# EAGLE schematic ALU (EAGLE 9.6.2)

## Sheet 1 of 8: Bus and A-bus end.
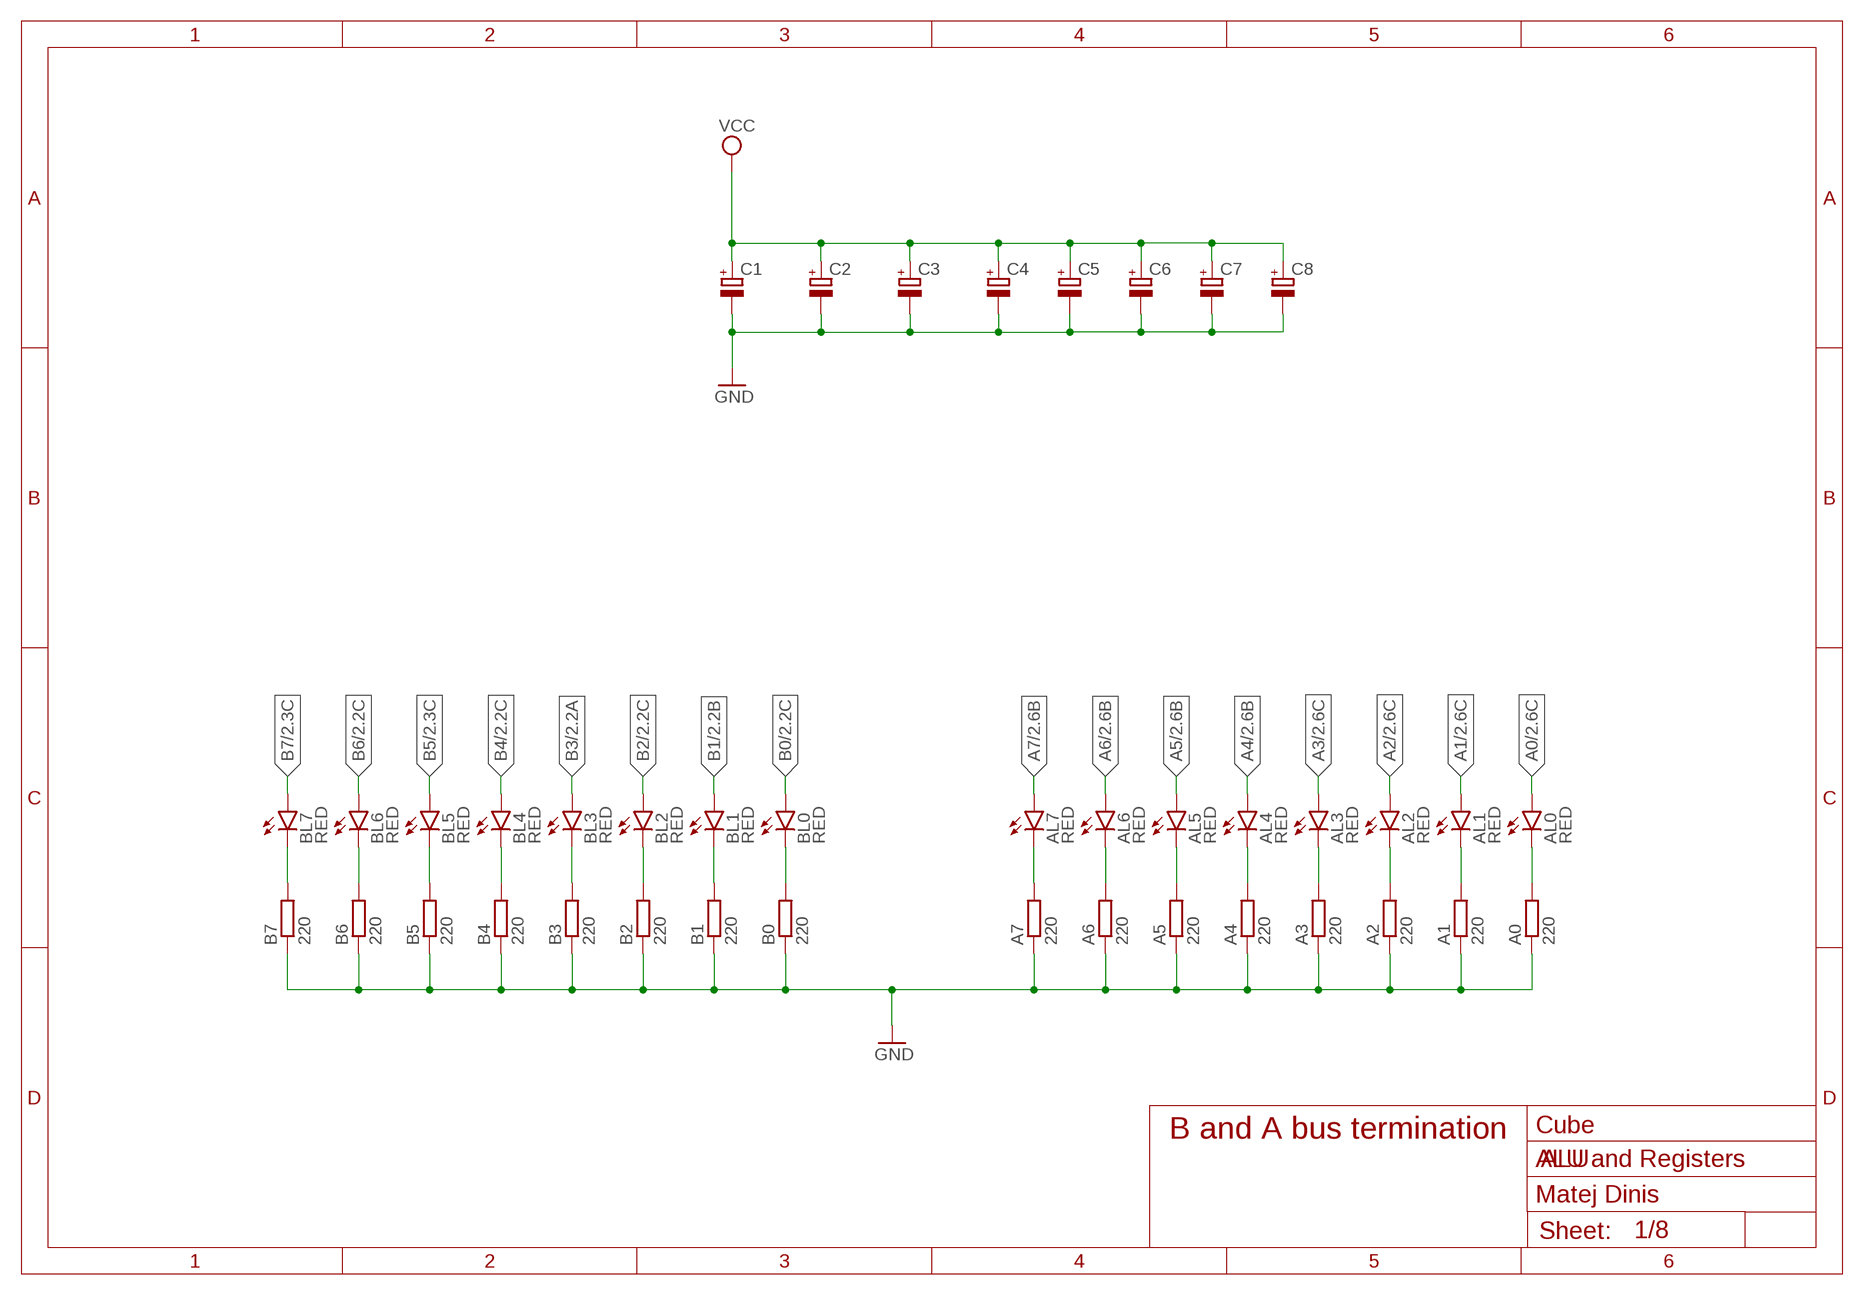
[diagram p0: schematic, sheet 1]

### Parts
A0  220  R-EU_0204/7  [0204/7]
A1  220  R-EU_0204/7  [0204/7]
A2  220  R-EU_0204/7  [0204/7]
A3  220  R-EU_0204/7  [0204/7]
A4  220  R-EU_0204/7  [0204/7]
A5  220  R-EU_0204/7  [0204/7]
A6  220  R-EU_0204/7  [0204/7]
A7  220  R-EU_0204/7  [0204/7]
AL0  RED  LED5MM  [LED5MM]
AL1  RED  LED5MM  [LED5MM]
AL2  RED  LED5MM  [LED5MM]
AL3  RED  LED5MM  [LED5MM]
AL4  RED  LED5MM  [LED5MM]
AL5  RED  LED5MM  [LED5MM]
AL6  RED  LED5MM  [LED5MM]
AL7  RED  LED5MM  [LED5MM]
B0  220  R-EU_0204/7  [0204/7]
B1  220  R-EU_0204/7  [0204/7]
B2  220  R-EU_0204/7  [0204/7]
B3  220  R-EU_0204/7  [0204/7]
B4  220  R-EU_0204/7  [0204/7]
B5  220  R-EU_0204/7  [0204/7]
B6  220  R-EU_0204/7  [0204/7]
B7  220  R-EU_0204/7  [0204/7]
BL0  RED  LED5MM  [LED5MM]
BL1  RED  LED5MM  [LED5MM]
BL2  RED  LED5MM  [LED5MM]
BL3  RED  LED5MM  [LED5MM]
BL4  RED  LED5MM  [LED5MM]
BL5  RED  LED5MM  [LED5MM]
BL6  RED  LED5MM  [LED5MM]
BL7  RED  LED5MM  [LED5MM]
C1  CPOL-EUE3.5-8  [E3,5-8]
C2  CPOL-EUE3.5-8  [E3,5-8]
C3  CPOL-EUE3.5-8  [E3,5-8]
C4  CPOL-EUE3.5-8  [E3,5-8]
C5  CPOL-EUE3.5-8  [E3,5-8]
C6  CPOL-EUE3.5-8  [E3,5-8]
C7  CPOL-EUE3.5-8  [E3,5-8]
C8  CPOL-EUE3.5-8  [E3,5-8]

### Nets
A0: AL0.A ; also sheet 2,3,4,5,6,7,8
A1: AL1.A ; also sheet 2,3,4,5,6,7,8
A2: AL2.A ; also sheet 2,3,4,5,6,7,8
A3: AL3.A ; also sheet 2,3,4,5,6,7,8
A4: AL4.A ; also sheet 2,3,4,5,6,7,8
A5: AL5.A ; also sheet 2,3,4,5,6,7,8
A6: AL6.A ; also sheet 2,3,4,5,6,7,8
A7: AL7.A ; also sheet 2,3,4,5,6,7,8
AL0: A0.2 AL0.K(C)
AL1: A1.2 AL1.K(C)
AL2: A2.2 AL2.K(C)
AL3: A3.2 AL3.K(C)
AL4: A4.2 AL4.K(C)
AL5: A5.2 AL5.K(C)
AL6: A6.2 AL6.K(C)
AL7: A7.2 AL7.K(C)
B0: BL0.A ; also sheet 2,3,4,5,6,7,8
B1: BL1.A ; also sheet 2,3,4,5,6,7,8
B2: BL2.A ; also sheet 2,3,4,5,6,7,8
B3: BL3.A ; also sheet 2,3,4,5,6,7,8
B4: BL4.A ; also sheet 2,3,4,5,6,7,8
B5: BL5.A ; also sheet 2,3,4,5,6,7,8
B6: BL6.A ; also sheet 2,3,4,5,6,7,8
B7: BL7.A ; also sheet 2,3,4,5,6,7,8
BL0: B0.2 BL0.K(C)
BL1: B1.2 BL1.K(C)
BL2: B2.2 BL2.K(C)
BL3: B3.2 BL3.K(C)
BL4: B4.2 BL4.K(C)
BL5: B5.2 BL5.K(C)
BL6: B6.2 BL6.K(C)
BL7: B7.2 BL7.K(C)
GND: A0.1 A1.1 A2.1 A3.1 A4.1 A5.1 A6.1 A7.1 B0.1 B1.1 B2.1 B3.1 B4.1 B5.1 B6.1 B7.1 C1.- C2.- C3.- C4.- C5.- C6.- C7.- C8.- ; also sheet 2,3,4,5,6,7,8
VCC: C1.+ C2.+ C3.+ C4.+ C5.+ C6.+ C7.+ C8.+ ; also sheet 2,3,4,5,6,7,8

### Notes on the sheet
- B and A bus termination | Cube
- ALU and Registers
- Matej Dinis

## Sheet 2 of 8: X Register
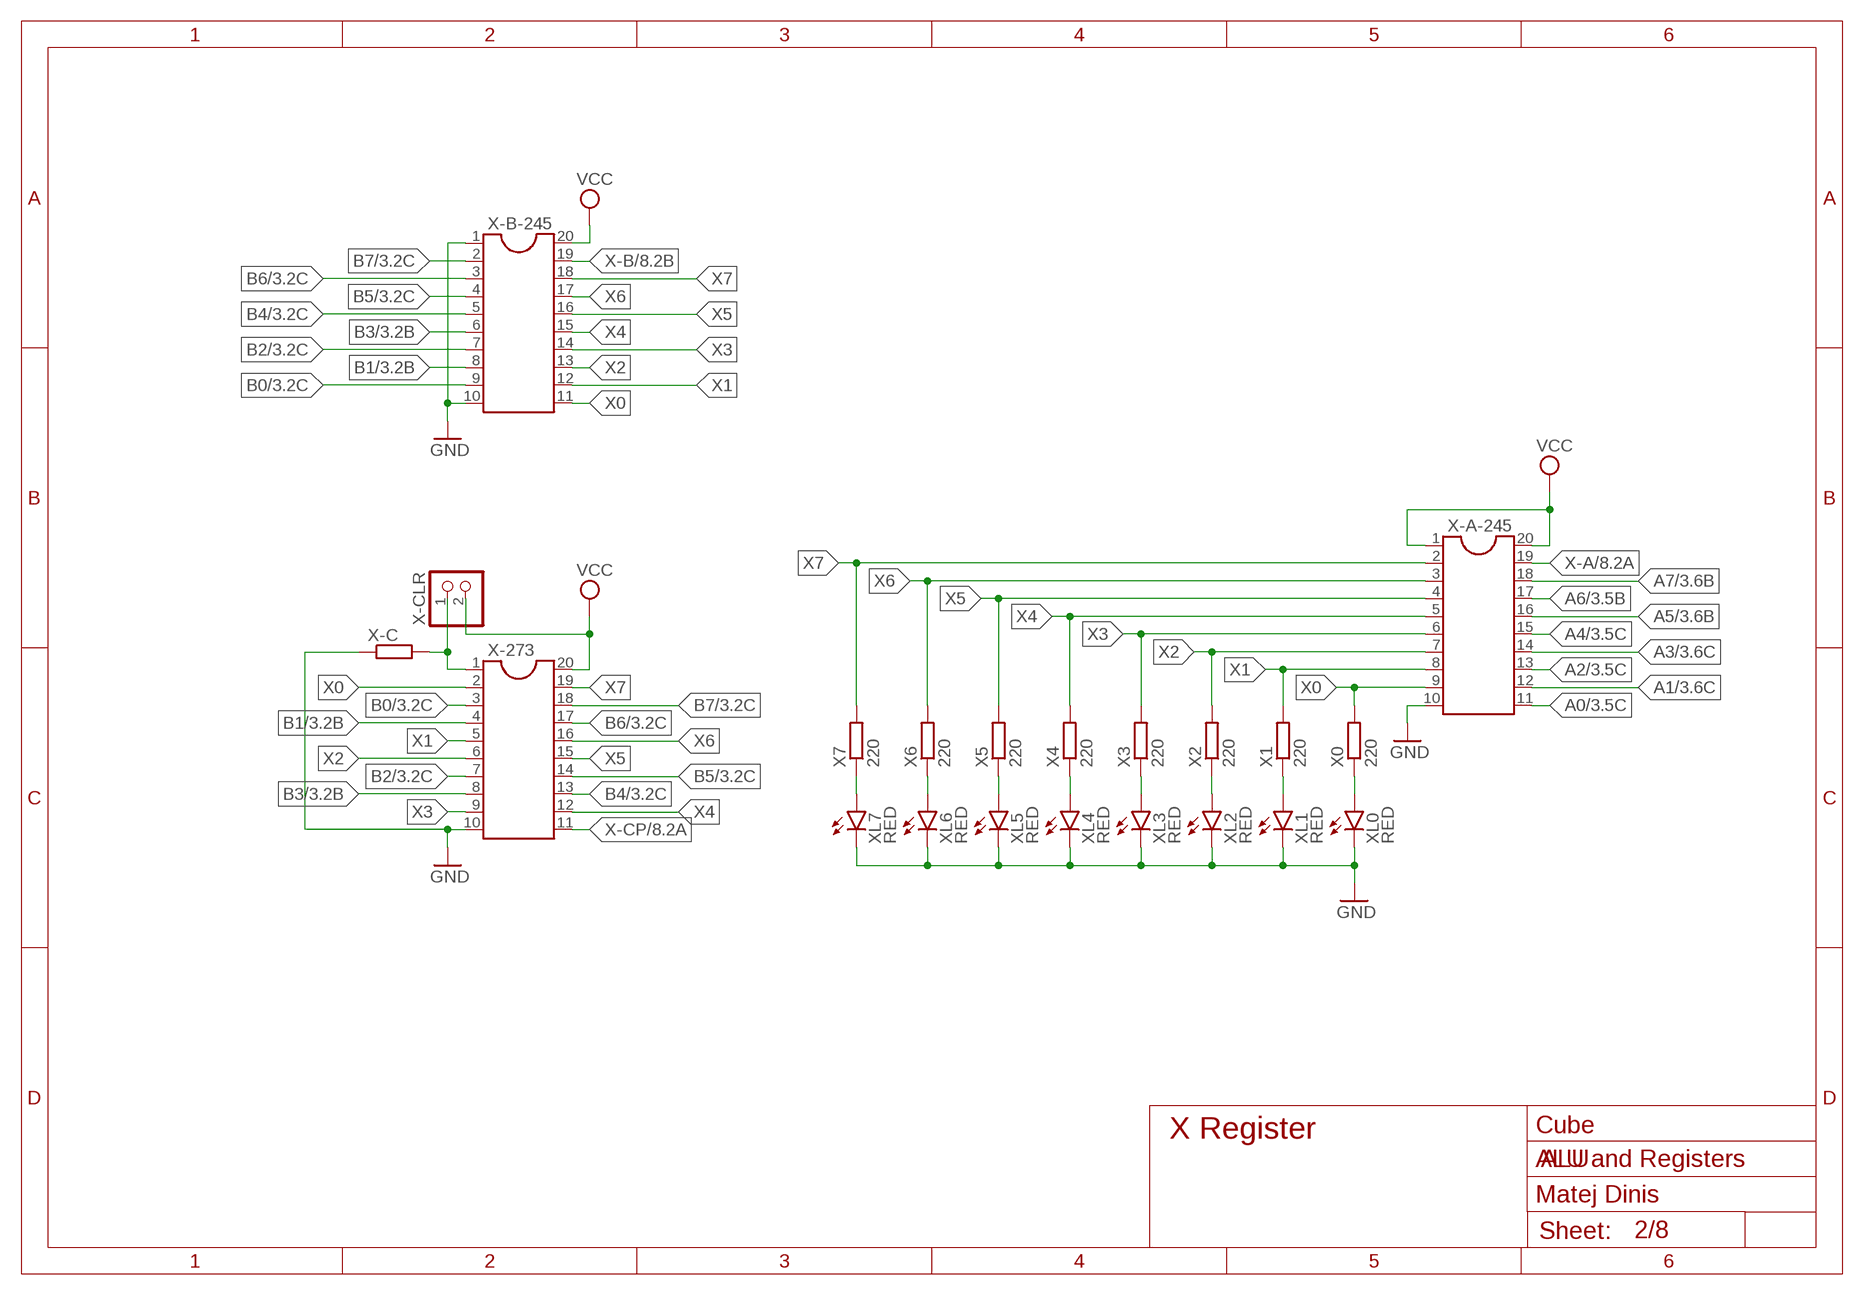
[diagram p1: schematic, sheet 2]

### Parts
X0  220  R-EU_0204/7  [0204/7]
X1  220  R-EU_0204/7  [0204/7]
X2  220  R-EU_0204/7  [0204/7]
X3  220  R-EU_0204/7  [0204/7]
X4  220  R-EU_0204/7  [0204/7]
X5  220  R-EU_0204/7  [0204/7]
X6  220  R-EU_0204/7  [0204/7]
X7  220  R-EU_0204/7  [0204/7]
X-273  DIL20S  [SOCKET-20]
X-A-245  DIL20S  [SOCKET-20]
X-B-245  DIL20S  [SOCKET-20]
X-C  R-EU_0204/7  [0204/7]
X-CLR  PINHD-1X2  [1X02]
XL0  RED  LED5MM  [LED5MM]
XL1  RED  LED5MM  [LED5MM]
XL2  RED  LED5MM  [LED5MM]
XL3  RED  LED5MM  [LED5MM]
XL4  RED  LED5MM  [LED5MM]
XL5  RED  LED5MM  [LED5MM]
XL6  RED  LED5MM  [LED5MM]
XL7  RED  LED5MM  [LED5MM]

### Nets
A0: X-A-245.11 ; also sheet 1,3,4,5,6,7,8
A1: X-A-245.12 ; also sheet 1,3,4,5,6,7,8
A2: X-A-245.13 ; also sheet 1,3,4,5,6,7,8
A3: X-A-245.14 ; also sheet 1,3,4,5,6,7,8
A4: X-A-245.15 ; also sheet 1,3,4,5,6,7,8
A5: X-A-245.16 ; also sheet 1,3,4,5,6,7,8
A6: X-A-245.17 ; also sheet 1,3,4,5,6,7,8
A7: X-A-245.18 ; also sheet 1,3,4,5,6,7,8
B0: X-273.3 X-B-245.9 ; also sheet 1,3,4,5,6,7,8
B1: X-273.4 X-B-245.8 ; also sheet 1,3,4,5,6,7,8
B2: X-273.7 X-B-245.7 ; also sheet 1,3,4,5,6,7,8
B3: X-273.8 X-B-245.6 ; also sheet 1,3,4,5,6,7,8
B4: X-273.13 X-B-245.5 ; also sheet 1,3,4,5,6,7,8
B5: X-273.14 X-B-245.4 ; also sheet 1,3,4,5,6,7,8
B6: X-273.17 X-B-245.3 ; also sheet 1,3,4,5,6,7,8
B7: X-273.18 X-B-245.2 ; also sheet 1,3,4,5,6,7,8
GND: X-273.10 X-A-245.10 X-B-245.1 X-B-245.10 X-C.1 XL0.K(C) XL1.K(C) XL2.K(C) XL3.K(C) XL4.K(C) XL5.K(C) XL6.K(C) XL7.K(C) ; also sheet 1,3,4,5,6,7,8
VCC: X-273.20 X-A-245.1 X-A-245.20 X-B-245.20 X-CLR.2 ; also sheet 1,3,4,5,6,7,8
X0: X0.2 X-273.2 X-A-245.9 X-B-245.11
X1: X1.2 X-273.5 X-A-245.8 X-B-245.12
X2: X2.2 X-273.6 X-A-245.7 X-B-245.13
X3: X3.2 X-273.9 X-A-245.6 X-B-245.14
X4: X4.2 X-273.12 X-A-245.5 X-B-245.15
X5: X5.2 X-273.15 X-A-245.4 X-B-245.16
X6: X6.2 X-273.16 X-A-245.3 X-B-245.17
X7: X7.2 X-273.19 X-A-245.2 X-B-245.18
X-A: X-A-245.19 ; also sheet 8
X-B: X-B-245.19 ; also sheet 8
X-CLR: X-273.1 X-C.2 X-CLR.1
X-CP: X-273.11 ; also sheet 8
XL0: X0.1 XL0.A
XL1: X1.1 XL1.A
XL2: X2.1 XL2.A
XL3: X3.1 XL3.A
XL4: X4.1 XL4.A
XL5: X5.1 XL5.A
XL6: X6.1 XL6.A
XL7: X7.1 XL7.A

### Notes on the sheet
- X Register | Cube
- ALU and Registers
- Matej Dinis

## Sheet 3 of 8: Y Register
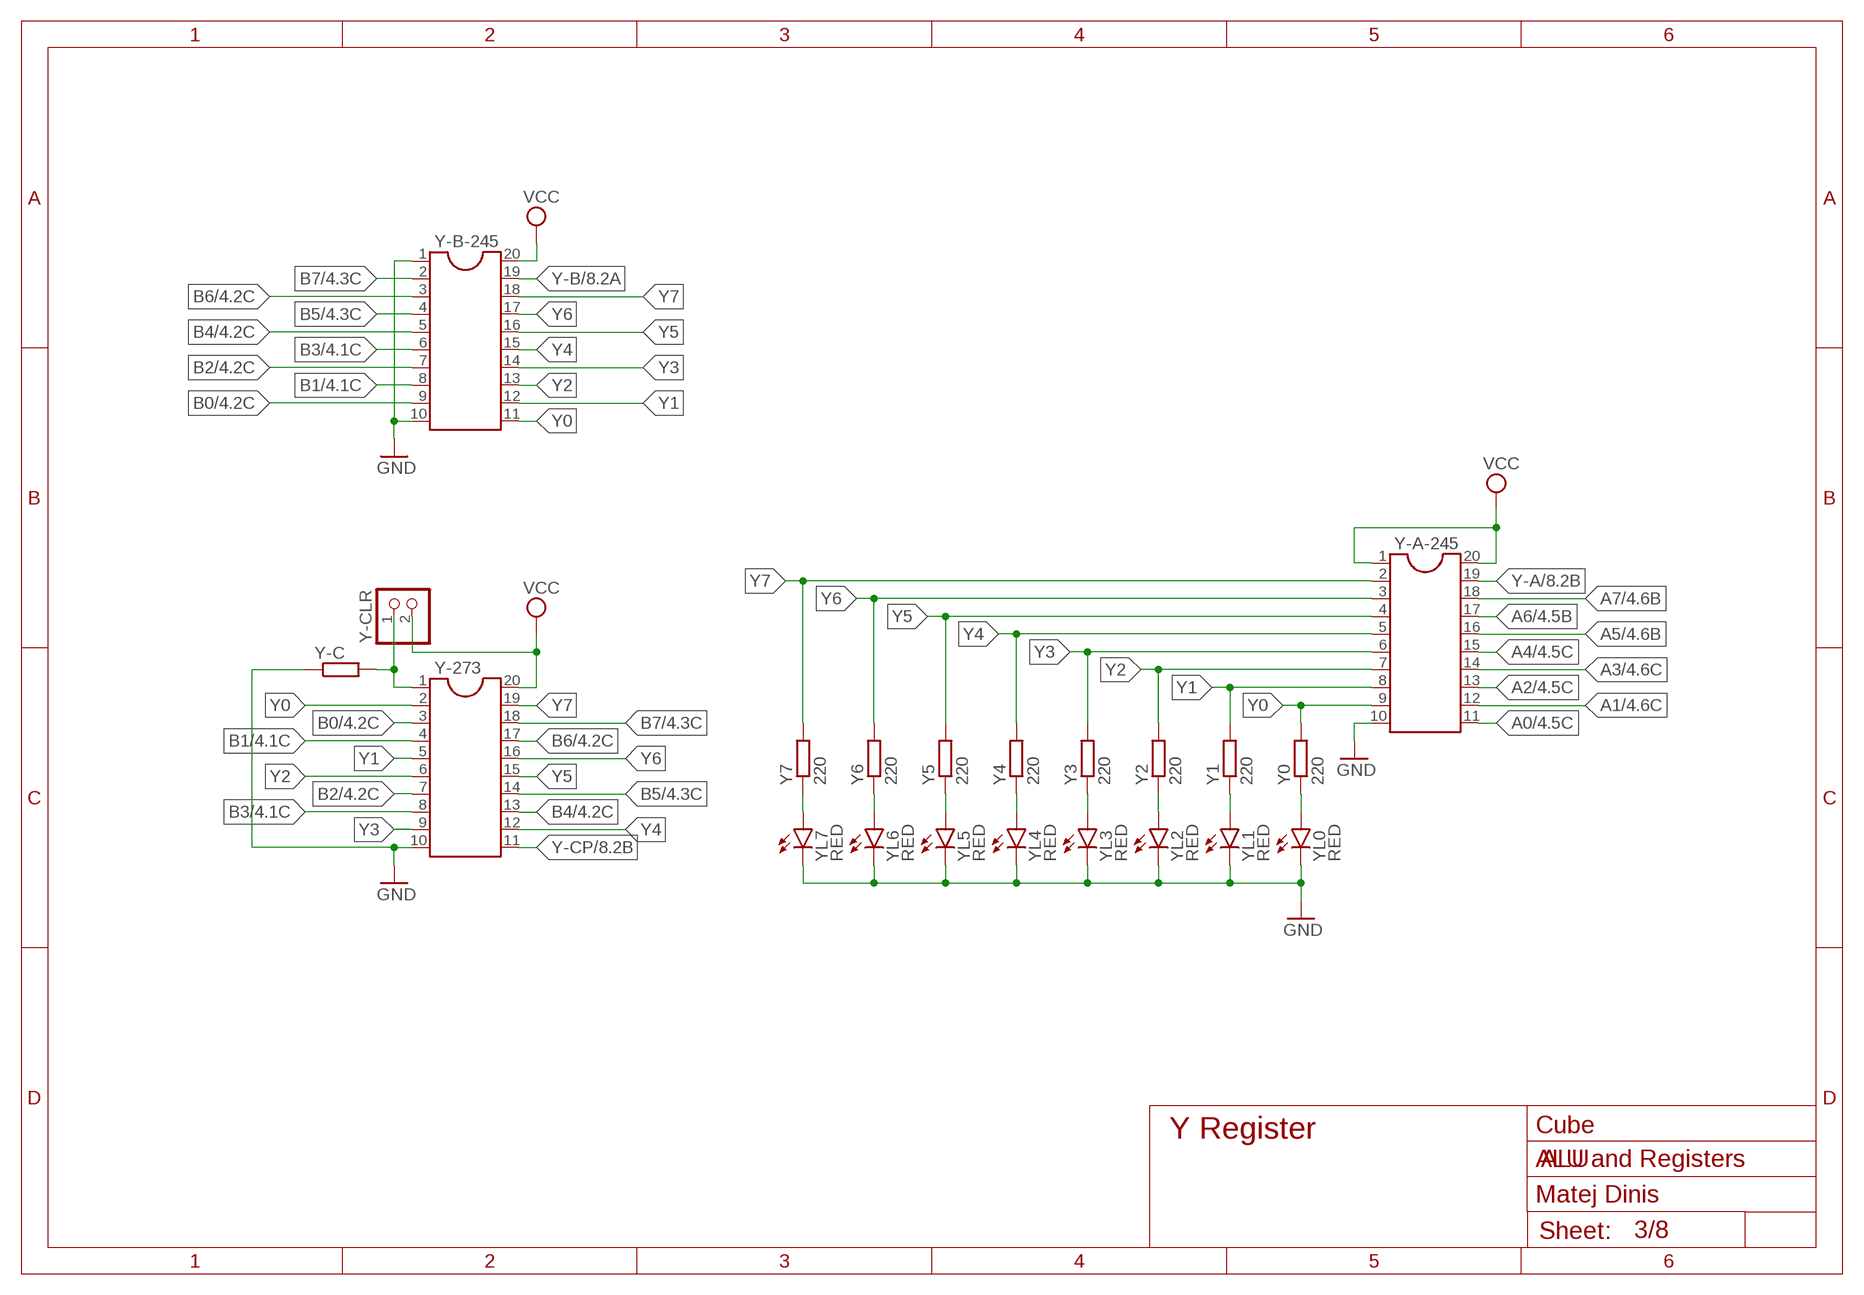
[diagram p2: schematic, sheet 3]

### Parts
Y0  220  R-EU_0204/7  [0204/7]
Y1  220  R-EU_0204/7  [0204/7]
Y2  220  R-EU_0204/7  [0204/7]
Y3  220  R-EU_0204/7  [0204/7]
Y4  220  R-EU_0204/7  [0204/7]
Y5  220  R-EU_0204/7  [0204/7]
Y6  220  R-EU_0204/7  [0204/7]
Y7  220  R-EU_0204/7  [0204/7]
Y-273  DIL20S  [SOCKET-20]
Y-A-245  DIL20S  [SOCKET-20]
Y-B-245  DIL20S  [SOCKET-20]
Y-C  R-EU_0204/7  [0204/7]
Y-CLR  PINHD-1X2  [1X02]
YL0  RED  LED5MM  [LED5MM]
YL1  RED  LED5MM  [LED5MM]
YL2  RED  LED5MM  [LED5MM]
YL3  RED  LED5MM  [LED5MM]
YL4  RED  LED5MM  [LED5MM]
YL5  RED  LED5MM  [LED5MM]
YL6  RED  LED5MM  [LED5MM]
YL7  RED  LED5MM  [LED5MM]

### Nets
A0: Y-A-245.11 ; also sheet 1,2,4,5,6,7,8
A1: Y-A-245.12 ; also sheet 1,2,4,5,6,7,8
A2: Y-A-245.13 ; also sheet 1,2,4,5,6,7,8
A3: Y-A-245.14 ; also sheet 1,2,4,5,6,7,8
A4: Y-A-245.15 ; also sheet 1,2,4,5,6,7,8
A5: Y-A-245.16 ; also sheet 1,2,4,5,6,7,8
A6: Y-A-245.17 ; also sheet 1,2,4,5,6,7,8
A7: Y-A-245.18 ; also sheet 1,2,4,5,6,7,8
B0: Y-273.3 Y-B-245.9 ; also sheet 1,2,4,5,6,7,8
B1: Y-273.4 Y-B-245.8 ; also sheet 1,2,4,5,6,7,8
B2: Y-273.7 Y-B-245.7 ; also sheet 1,2,4,5,6,7,8
B3: Y-273.8 Y-B-245.6 ; also sheet 1,2,4,5,6,7,8
B4: Y-273.13 Y-B-245.5 ; also sheet 1,2,4,5,6,7,8
B5: Y-273.14 Y-B-245.4 ; also sheet 1,2,4,5,6,7,8
B6: Y-273.17 Y-B-245.3 ; also sheet 1,2,4,5,6,7,8
B7: Y-273.18 Y-B-245.2 ; also sheet 1,2,4,5,6,7,8
GND: Y-273.10 Y-A-245.10 Y-B-245.1 Y-B-245.10 Y-C.1 YL0.K(C) YL1.K(C) YL2.K(C) YL3.K(C) YL4.K(C) YL5.K(C) YL6.K(C) YL7.K(C) ; also sheet 1,2,4,5,6,7,8
VCC: Y-273.20 Y-A-245.1 Y-A-245.20 Y-B-245.20 Y-CLR.2 ; also sheet 1,2,4,5,6,7,8
Y0: Y0.2 Y-273.2 Y-A-245.9 Y-B-245.11
Y1: Y1.2 Y-273.5 Y-A-245.8 Y-B-245.12
Y2: Y2.2 Y-273.6 Y-A-245.7 Y-B-245.13
Y3: Y3.2 Y-273.9 Y-A-245.6 Y-B-245.14
Y4: Y4.2 Y-273.12 Y-A-245.5 Y-B-245.15
Y5: Y5.2 Y-273.15 Y-A-245.4 Y-B-245.16
Y6: Y6.2 Y-273.16 Y-A-245.3 Y-B-245.17
Y7: Y7.2 Y-273.19 Y-A-245.2 Y-B-245.18
Y-A: Y-A-245.19 ; also sheet 8
Y-B: Y-B-245.19 ; also sheet 8
Y-CLR: Y-273.1 Y-C.2 Y-CLR.1
Y-CP: Y-273.11 ; also sheet 8
YL0: Y0.1 YL0.A
YL1: Y1.1 YL1.A
YL2: Y2.1 YL2.A
YL3: Y3.1 YL3.A
YL4: Y4.1 YL4.A
YL5: Y5.1 YL5.A
YL6: Y6.1 YL6.A
YL7: Y7.1 YL7.A

### Notes on the sheet
- Y Register | Cube
- ALU and Registers
- Matej Dinis

## Sheet 4 of 8: Z Register
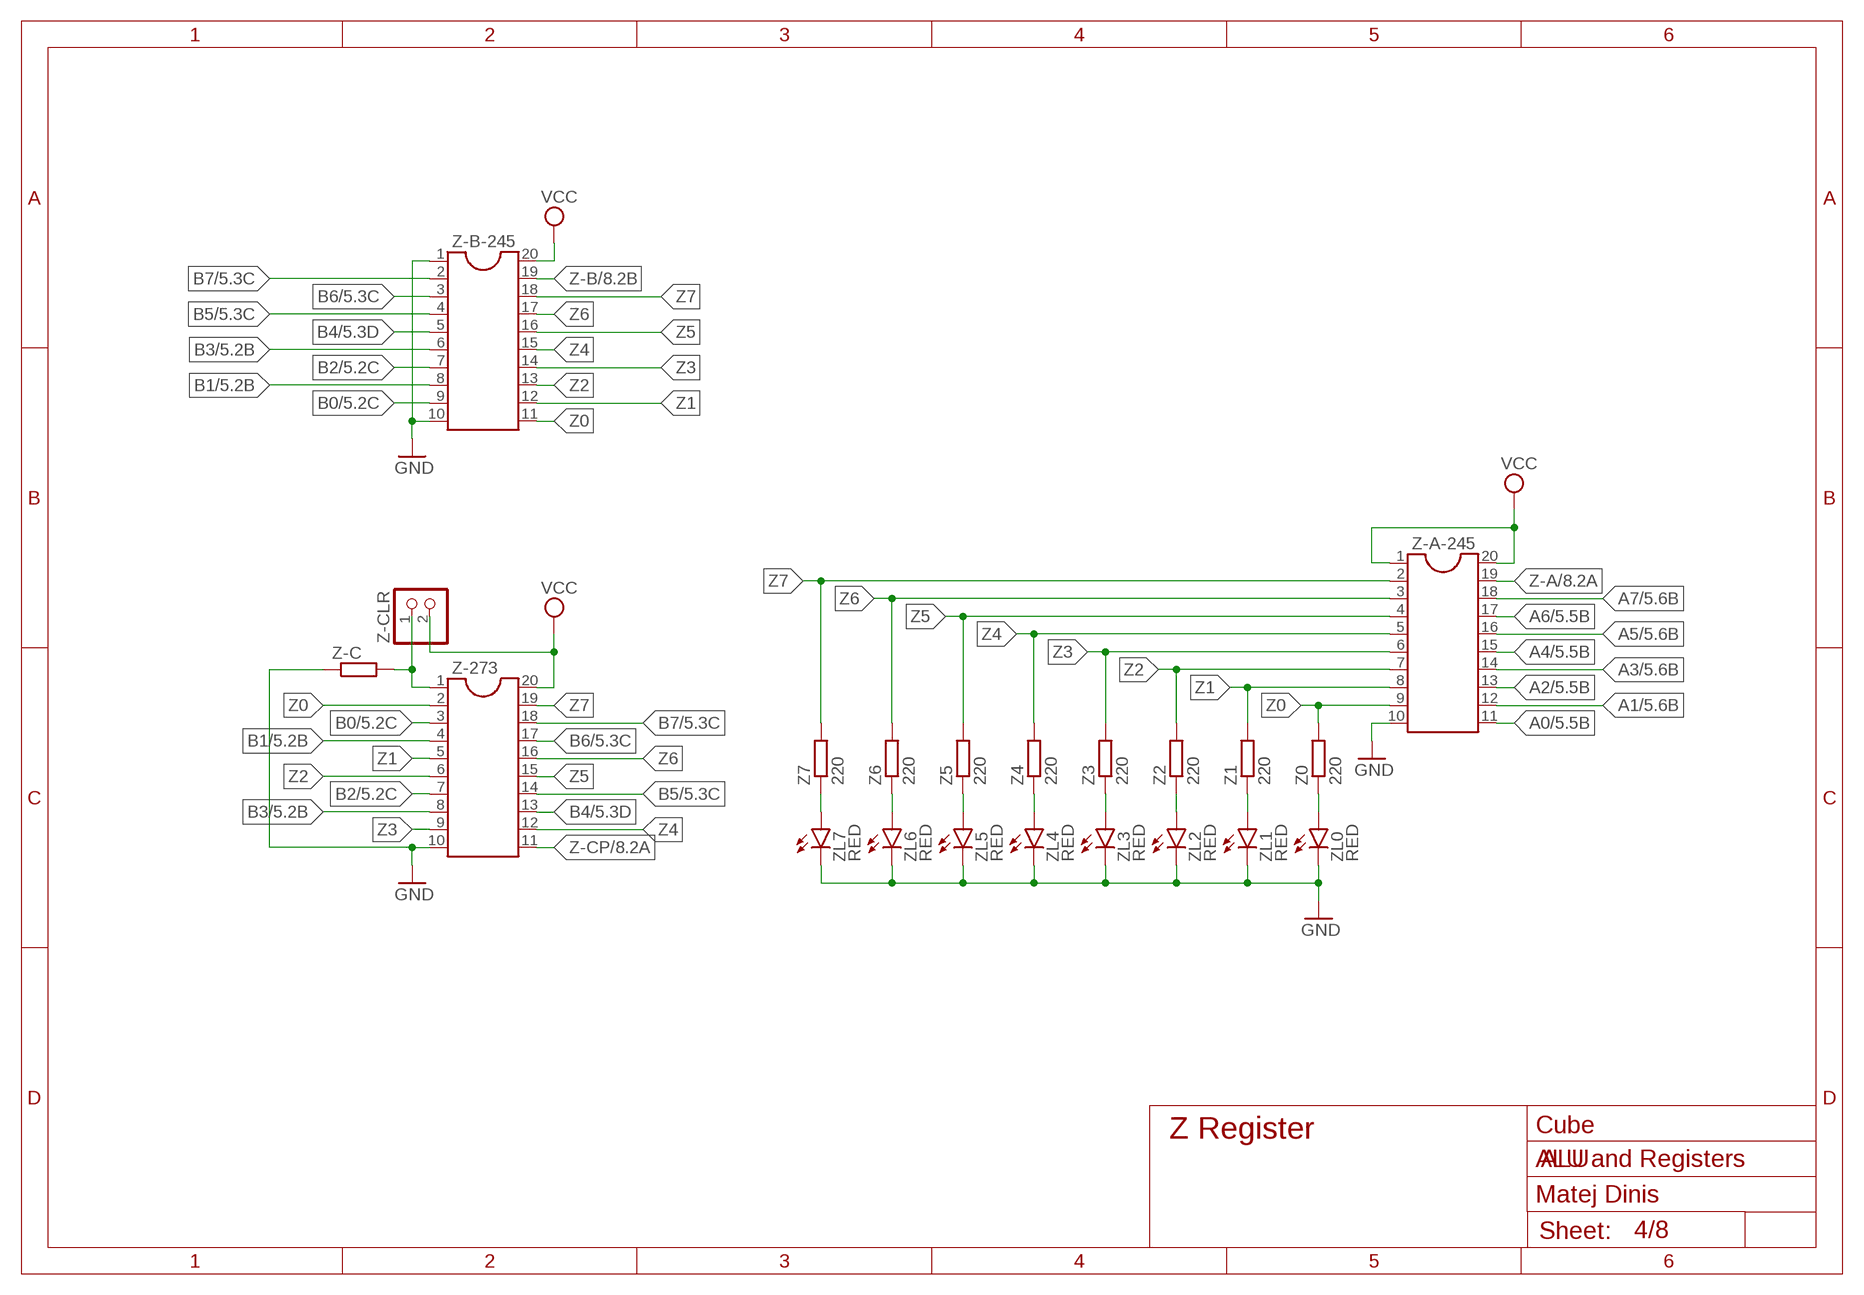
[diagram p3: schematic, sheet 4]

### Parts
Z0  220  R-EU_0204/7  [0204/7]
Z1  220  R-EU_0204/7  [0204/7]
Z2  220  R-EU_0204/7  [0204/7]
Z3  220  R-EU_0204/7  [0204/7]
Z4  220  R-EU_0204/7  [0204/7]
Z5  220  R-EU_0204/7  [0204/7]
Z6  220  R-EU_0204/7  [0204/7]
Z7  220  R-EU_0204/7  [0204/7]
Z-273  DIL20S  [SOCKET-20]
Z-A-245  DIL20S  [SOCKET-20]
Z-B-245  DIL20S  [SOCKET-20]
Z-C  R-EU_0204/7  [0204/7]
Z-CLR  PINHD-1X2  [1X02]
ZL0  RED  LED5MM  [LED5MM]
ZL1  RED  LED5MM  [LED5MM]
ZL2  RED  LED5MM  [LED5MM]
ZL3  RED  LED5MM  [LED5MM]
ZL4  RED  LED5MM  [LED5MM]
ZL5  RED  LED5MM  [LED5MM]
ZL6  RED  LED5MM  [LED5MM]
ZL7  RED  LED5MM  [LED5MM]

### Nets
A0: Z-A-245.11 ; also sheet 1,2,3,5,6,7,8
A1: Z-A-245.12 ; also sheet 1,2,3,5,6,7,8
A2: Z-A-245.13 ; also sheet 1,2,3,5,6,7,8
A3: Z-A-245.14 ; also sheet 1,2,3,5,6,7,8
A4: Z-A-245.15 ; also sheet 1,2,3,5,6,7,8
A5: Z-A-245.16 ; also sheet 1,2,3,5,6,7,8
A6: Z-A-245.17 ; also sheet 1,2,3,5,6,7,8
A7: Z-A-245.18 ; also sheet 1,2,3,5,6,7,8
B0: Z-273.3 Z-B-245.9 ; also sheet 1,2,3,5,6,7,8
B1: Z-273.4 Z-B-245.8 ; also sheet 1,2,3,5,6,7,8
B2: Z-273.7 Z-B-245.7 ; also sheet 1,2,3,5,6,7,8
B3: Z-273.8 Z-B-245.6 ; also sheet 1,2,3,5,6,7,8
B4: Z-273.13 Z-B-245.5 ; also sheet 1,2,3,5,6,7,8
B5: Z-273.14 Z-B-245.4 ; also sheet 1,2,3,5,6,7,8
B6: Z-273.17 Z-B-245.3 ; also sheet 1,2,3,5,6,7,8
B7: Z-273.18 Z-B-245.2 ; also sheet 1,2,3,5,6,7,8
GND: Z-273.10 Z-A-245.10 Z-B-245.1 Z-B-245.10 Z-C.1 ZL0.K(C) ZL1.K(C) ZL2.K(C) ZL3.K(C) ZL4.K(C) ZL5.K(C) ZL6.K(C) ZL7.K(C) ; also sheet 1,2,3,5,6,7,8
VCC: Z-273.20 Z-A-245.1 Z-A-245.20 Z-B-245.20 Z-CLR.2 ; also sheet 1,2,3,5,6,7,8
Z0: Z0.2 Z-273.2 Z-A-245.9 Z-B-245.11
Z1: Z1.2 Z-273.5 Z-A-245.8 Z-B-245.12
Z2: Z2.2 Z-273.6 Z-A-245.7 Z-B-245.13
Z3: Z3.2 Z-273.9 Z-A-245.6 Z-B-245.14
Z4: Z4.2 Z-273.12 Z-A-245.5 Z-B-245.15
Z5: Z5.2 Z-273.15 Z-A-245.4 Z-B-245.16
Z6: Z6.2 Z-273.16 Z-A-245.3 Z-B-245.17
Z7: Z7.2 Z-273.19 Z-A-245.2 Z-B-245.18
Z-A: Z-A-245.19 ; also sheet 8
Z-B: Z-B-245.19 ; also sheet 8
Z-CLR: Z-273.1 Z-C.2 Z-CLR.1
Z-CP: Z-273.11 ; also sheet 8
ZL0: Z0.1 ZL0.A
ZL1: Z1.1 ZL1.A
ZL2: Z2.1 ZL2.A
ZL3: Z3.1 ZL3.A
ZL4: Z4.1 ZL4.A
ZL5: Z5.1 ZL5.A
ZL6: Z6.1 ZL6.A
ZL7: Z7.1 ZL7.A

### Notes on the sheet
- Z Register | Cube
- ALU and Registers
- Matej Dinis

## Sheet 5 of 8: ACC Register
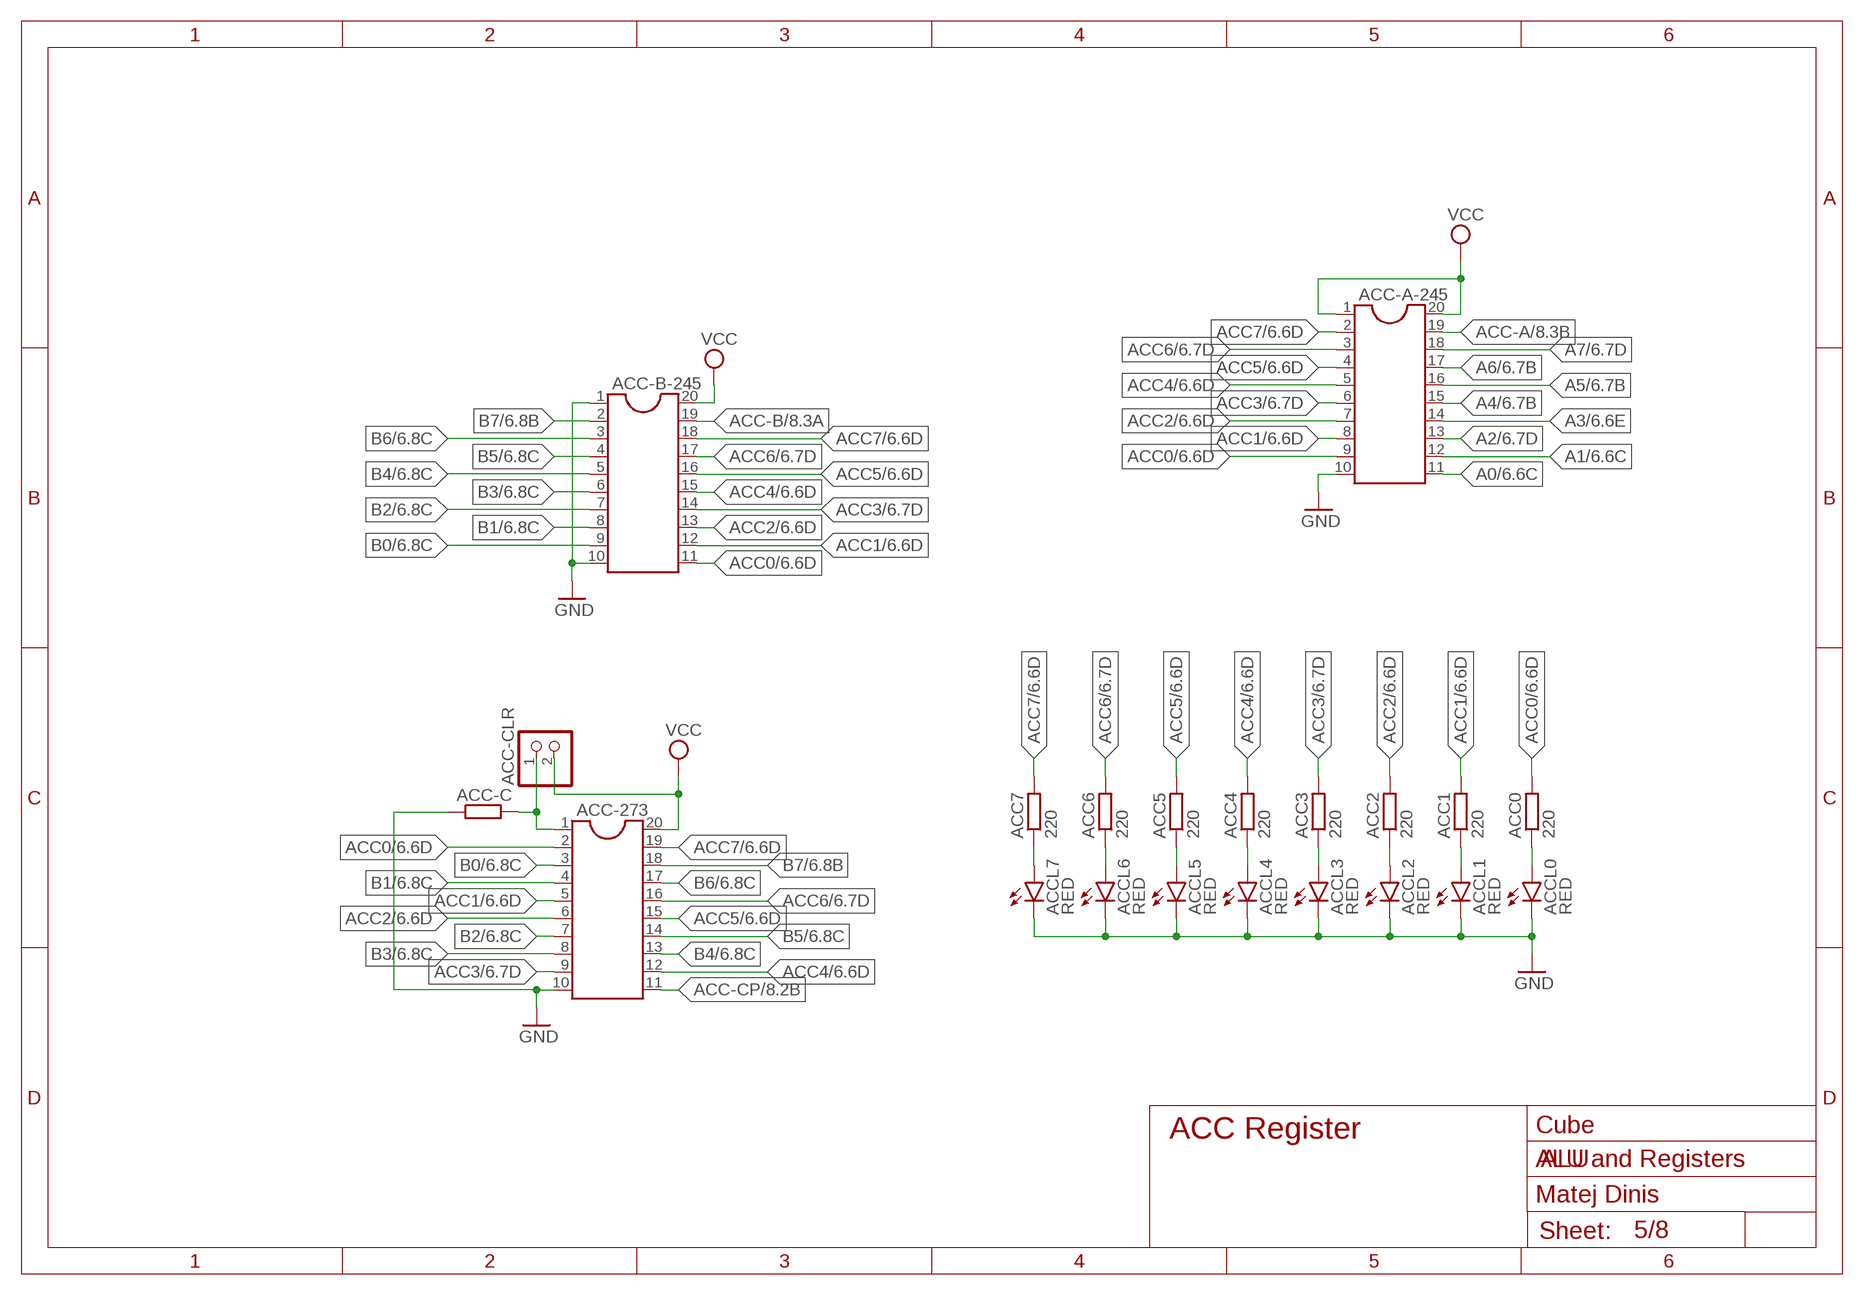
[diagram p4: schematic, sheet 5]

### Parts
ACC0  220  R-EU_0204/7  [0204/7]
ACC1  220  R-EU_0204/7  [0204/7]
ACC2  220  R-EU_0204/7  [0204/7]
ACC3  220  R-EU_0204/7  [0204/7]
ACC4  220  R-EU_0204/7  [0204/7]
ACC5  220  R-EU_0204/7  [0204/7]
ACC6  220  R-EU_0204/7  [0204/7]
ACC7  220  R-EU_0204/7  [0204/7]
ACC-273  DIL20S  [SOCKET-20]
ACC-A-245  DIL20S  [SOCKET-20]
ACC-B-245  DIL20S  [SOCKET-20]
ACC-C  R-EU_0204/7  [0204/7]
ACC-CLR  PINHD-1X2  [1X02]
ACCL0  RED  LED5MM  [LED5MM]
ACCL1  RED  LED5MM  [LED5MM]
ACCL2  RED  LED5MM  [LED5MM]
ACCL3  RED  LED5MM  [LED5MM]
ACCL4  RED  LED5MM  [LED5MM]
ACCL5  RED  LED5MM  [LED5MM]
ACCL6  RED  LED5MM  [LED5MM]
ACCL7  RED  LED5MM  [LED5MM]

### Nets
A0: ACC-A-245.11 ; also sheet 1,2,3,4,6,7,8
A1: ACC-A-245.12 ; also sheet 1,2,3,4,6,7,8
A2: ACC-A-245.13 ; also sheet 1,2,3,4,6,7,8
A3: ACC-A-245.14 ; also sheet 1,2,3,4,6,7,8
A4: ACC-A-245.15 ; also sheet 1,2,3,4,6,7,8
A5: ACC-A-245.16 ; also sheet 1,2,3,4,6,7,8
A6: ACC-A-245.17 ; also sheet 1,2,3,4,6,7,8
A7: ACC-A-245.18 ; also sheet 1,2,3,4,6,7,8
ACC0: ACC0.2 ACC-273.2 ACC-A-245.9 ACC-B-245.11 ; also sheet 6,7
ACC1: ACC1.2 ACC-273.5 ACC-A-245.8 ACC-B-245.12 ; also sheet 6,7
ACC2: ACC2.2 ACC-273.6 ACC-A-245.7 ACC-B-245.13 ; also sheet 6,7
ACC3: ACC3.2 ACC-273.9 ACC-A-245.6 ACC-B-245.14 ; also sheet 6,7
ACC4: ACC4.2 ACC-273.12 ACC-A-245.5 ACC-B-245.15 ; also sheet 6,7
ACC5: ACC5.2 ACC-273.15 ACC-A-245.4 ACC-B-245.16 ; also sheet 6,7
ACC6: ACC6.2 ACC-273.16 ACC-A-245.3 ACC-B-245.17 ; also sheet 6,7
ACC7: ACC7.2 ACC-273.19 ACC-A-245.2 ACC-B-245.18 ; also sheet 6,7
ACC-A: ACC-A-245.19 ; also sheet 8
ACC-B: ACC-B-245.19 ; also sheet 8
ACC-CLR: ACC-273.1 ACC-C.2 ACC-CLR.1
ACC-CP: ACC-273.11 ; also sheet 8
ACCL0: ACC0.1 ACCL0.A
ACCL1: ACC1.1 ACCL1.A
ACCL2: ACC2.1 ACCL2.A
ACCL3: ACC3.1 ACCL3.A
ACCL4: ACC4.1 ACCL4.A
ACCL5: ACC5.1 ACCL5.A
ACCL6: ACC6.1 ACCL6.A
ACCL7: ACC7.1 ACCL7.A
B0: ACC-273.3 ACC-B-245.9 ; also sheet 1,2,3,4,6,7,8
B1: ACC-273.4 ACC-B-245.8 ; also sheet 1,2,3,4,6,7,8
B2: ACC-273.7 ACC-B-245.7 ; also sheet 1,2,3,4,6,7,8
B3: ACC-273.8 ACC-B-245.6 ; also sheet 1,2,3,4,6,7,8
B4: ACC-273.13 ACC-B-245.5 ; also sheet 1,2,3,4,6,7,8
B5: ACC-273.14 ACC-B-245.4 ; also sheet 1,2,3,4,6,7,8
B6: ACC-273.17 ACC-B-245.3 ; also sheet 1,2,3,4,6,7,8
B7: ACC-273.18 ACC-B-245.2 ; also sheet 1,2,3,4,6,7,8
GND: ACC-273.10 ACC-A-245.10 ACC-B-245.1 ACC-B-245.10 ACC-C.1 ACCL0.K(C) ACCL1.K(C) ACCL2.K(C) ACCL3.K(C) ACCL4.K(C) ACCL5.K(C) ACCL6.K(C) ACCL7.K(C) ; also sheet 1,2,3,4,6,7,8
VCC: ACC-273.20 ACC-A-245.1 ACC-A-245.20 ACC-B-245.20 ACC-CLR.2 ; also sheet 1,2,3,4,6,7,8

### Notes on the sheet
- ACC Register | Cube
- ALU and Registers
- Matej Dinis

## Sheet 6 of 8: ALU A,S,AND,OR,NOT,XOR
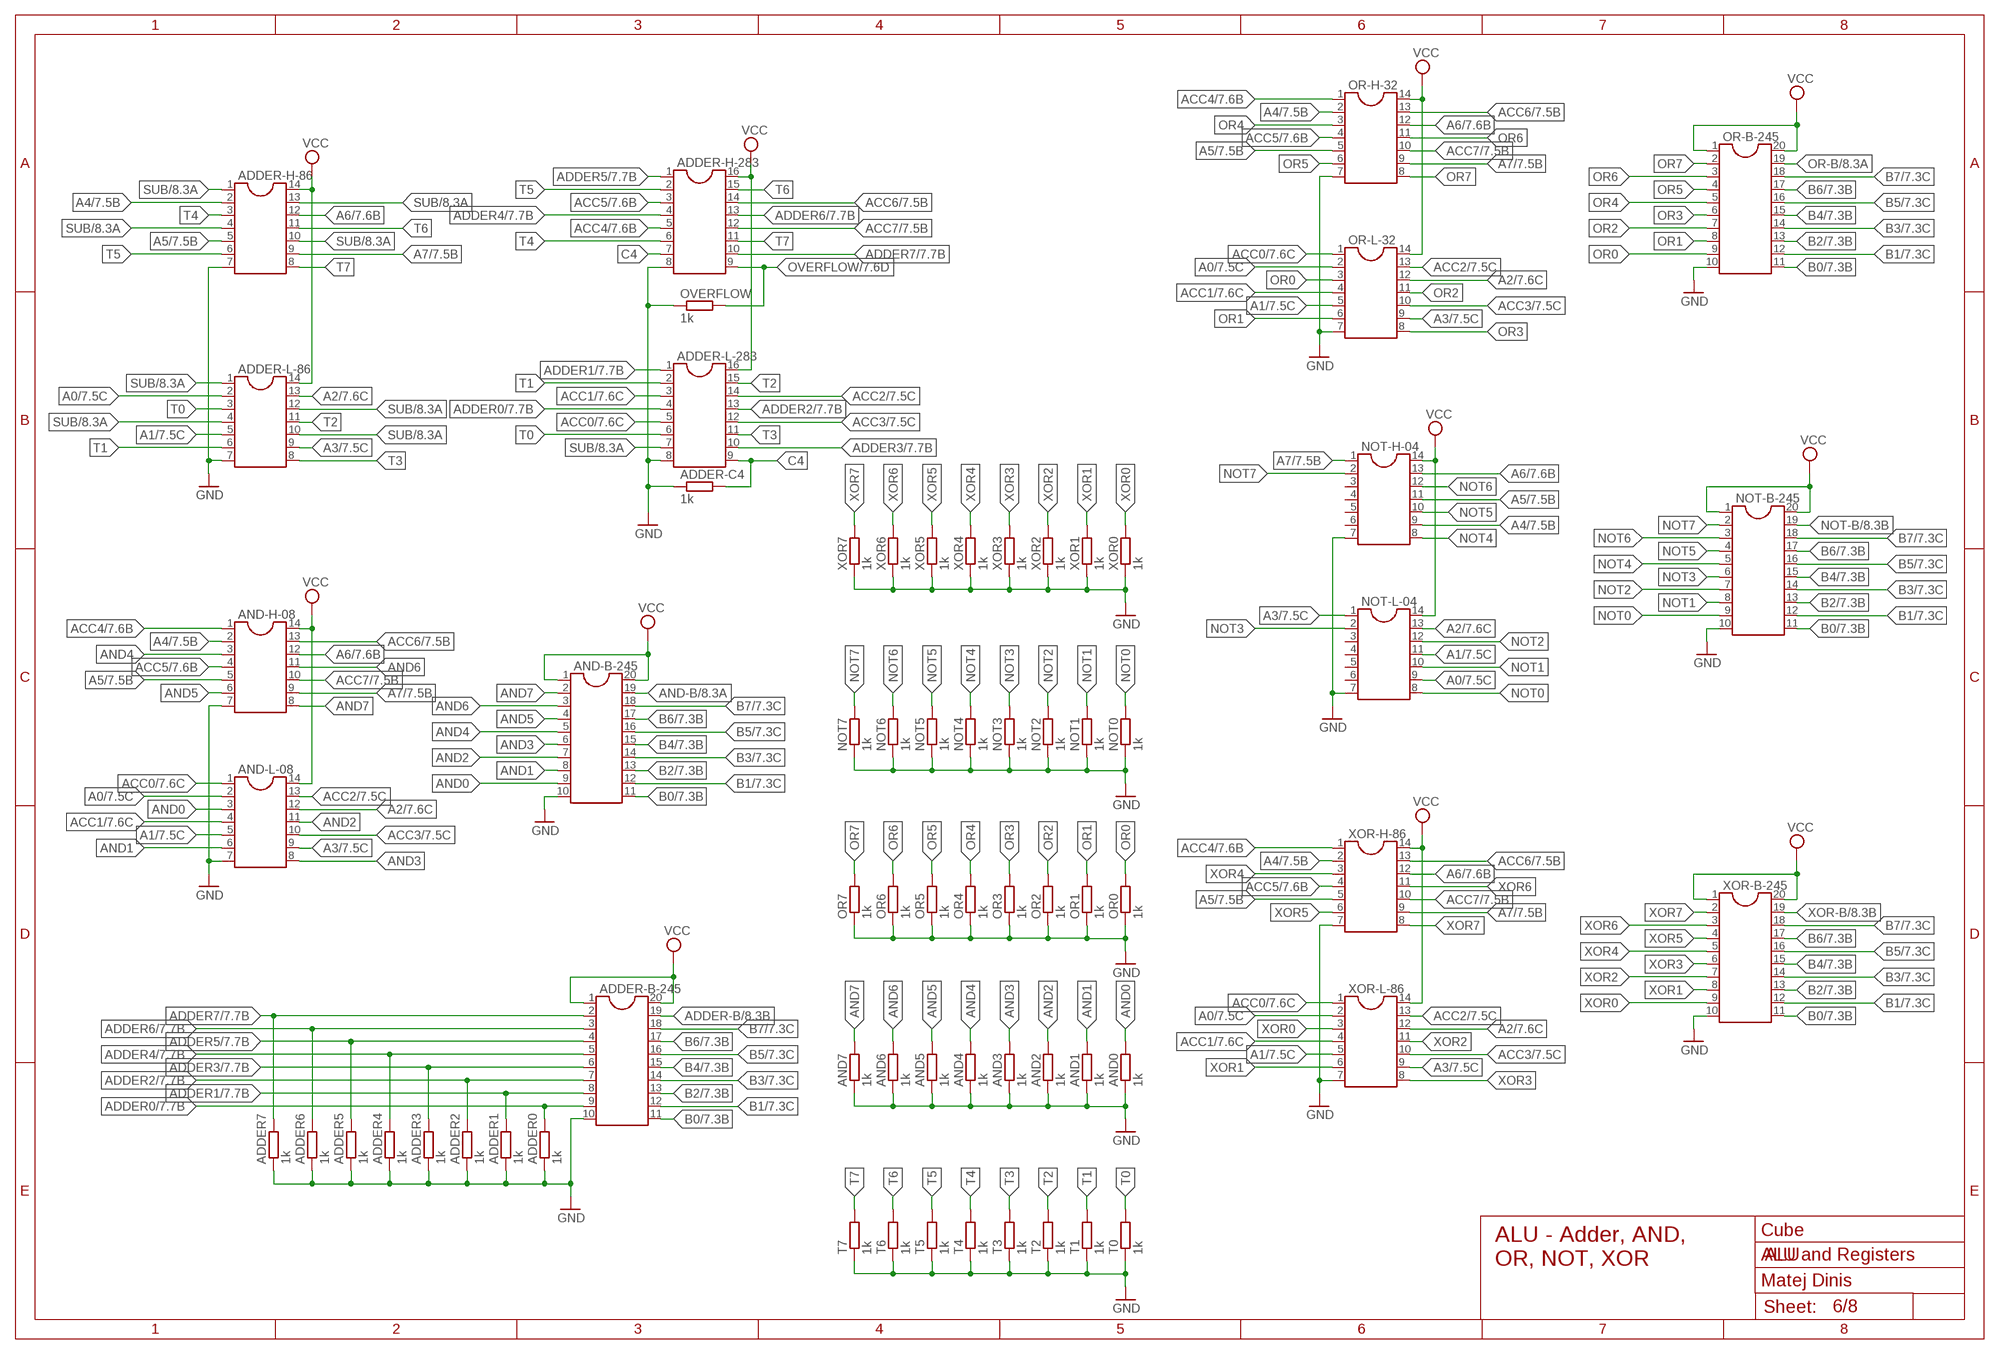
[diagram p5: schematic, sheet 6]

### Parts
ADDER0  1k  R-EU_0204/7  [0204/7]
ADDER1  1k  R-EU_0204/7  [0204/7]
ADDER2  1k  R-EU_0204/7  [0204/7]
ADDER3  1k  R-EU_0204/7  [0204/7]
ADDER4  1k  R-EU_0204/7  [0204/7]
ADDER5  1k  R-EU_0204/7  [0204/7]
ADDER6  1k  R-EU_0204/7  [0204/7]
ADDER7  1k  R-EU_0204/7  [0204/7]
ADDER-B-245  DIL20S  [SOCKET-20]
ADDER-C4  1k  R-EU_0204/7  [0204/7]
ADDER-H-86  DIL14S  [SOCKET-14]
ADDER-H-283  DIL16S  [SOCKET-16]
ADDER-L-86  DIL14S  [SOCKET-14]
ADDER-L-283  DIL16S  [SOCKET-16]
AND0  1k  R-EU_0204/7  [0204/7]
AND1  1k  R-EU_0204/7  [0204/7]
AND2  1k  R-EU_0204/7  [0204/7]
AND3  1k  R-EU_0204/7  [0204/7]
AND4  1k  R-EU_0204/7  [0204/7]
AND5  1k  R-EU_0204/7  [0204/7]
AND6  1k  R-EU_0204/7  [0204/7]
AND7  1k  R-EU_0204/7  [0204/7]
AND-B-245  DIL20S  [SOCKET-20]
AND-H-08  DIL14S  [SOCKET-14]
AND-L-08  DIL14S  [SOCKET-14]
NOT0  1k  R-EU_0204/7  [0204/7]
NOT1  1k  R-EU_0204/7  [0204/7]
NOT2  1k  R-EU_0204/7  [0204/7]
NOT3  1k  R-EU_0204/7  [0204/7]
NOT4  1k  R-EU_0204/7  [0204/7]
NOT5  1k  R-EU_0204/7  [0204/7]
NOT6  1k  R-EU_0204/7  [0204/7]
NOT7  1k  R-EU_0204/7  [0204/7]
NOT-B-245  DIL20S  [SOCKET-20]
NOT-H-04  DIL14S  [SOCKET-14]
NOT-L-04  DIL14S  [SOCKET-14]
OR0  1k  R-EU_0204/7  [0204/7]
OR1  1k  R-EU_0204/7  [0204/7]
OR2  1k  R-EU_0204/7  [0204/7]
OR3  1k  R-EU_0204/7  [0204/7]
OR4  1k  R-EU_0204/7  [0204/7]
OR5  1k  R-EU_0204/7  [0204/7]
OR6  1k  R-EU_0204/7  [0204/7]
OR7  1k  R-EU_0204/7  [0204/7]
OR-B-245  DIL20S  [SOCKET-20]
OR-H-32  DIL14S  [SOCKET-14]
OR-L-32  DIL14S  [SOCKET-14]
OVERFLOW  1k  R-EU_0204/7  [0204/7]
T0  1k  R-EU_0204/7  [0204/7]
T1  1k  R-EU_0204/7  [0204/7]
T2  1k  R-EU_0204/7  [0204/7]
T3  1k  R-EU_0204/7  [0204/7]
T4  1k  R-EU_0204/7  [0204/7]
T5  1k  R-EU_0204/7  [0204/7]
T6  1k  R-EU_0204/7  [0204/7]
T7  1k  R-EU_0204/7  [0204/7]
XOR0  1k  R-EU_0204/7  [0204/7]
XOR1  1k  R-EU_0204/7  [0204/7]
XOR2  1k  R-EU_0204/7  [0204/7]
XOR3  1k  R-EU_0204/7  [0204/7]
XOR4  1k  R-EU_0204/7  [0204/7]
XOR5  1k  R-EU_0204/7  [0204/7]
XOR6  1k  R-EU_0204/7  [0204/7]
XOR7  1k  R-EU_0204/7  [0204/7]
XOR-B-245  DIL20S  [SOCKET-20]
XOR-H-86  DIL14S  [SOCKET-14]
XOR-L-86  DIL14S  [SOCKET-14]

### Nets
A0: ADDER-L-86.2 AND-L-08.2 NOT-L-04.9 OR-L-32.2 XOR-L-86.2 ; also sheet 1,2,3,4,5,7,8
A1: ADDER-L-86.5 AND-L-08.5 NOT-L-04.11 OR-L-32.5 XOR-L-86.5 ; also sheet 1,2,3,4,5,7,8
A2: ADDER-L-86.13 AND-L-08.12 NOT-L-04.13 OR-L-32.12 XOR-L-86.12 ; also sheet 1,2,3,4,5,7,8
A3: ADDER-L-86.9 AND-L-08.9 NOT-L-04.1 OR-L-32.9 XOR-L-86.9 ; also sheet 1,2,3,4,5,7,8
A4: ADDER-H-86.2 AND-H-08.2 NOT-H-04.9 OR-H-32.2 XOR-H-86.2 ; also sheet 1,2,3,4,5,7,8
A5: ADDER-H-86.5 AND-H-08.5 NOT-H-04.11 OR-H-32.5 XOR-H-86.5 ; also sheet 1,2,3,4,5,7,8
A6: ADDER-H-86.12 AND-H-08.12 NOT-H-04.13 OR-H-32.12 XOR-H-86.12 ; also sheet 1,2,3,4,5,7,8
A7: ADDER-H-86.9 AND-H-08.9 NOT-H-04.1 OR-H-32.9 XOR-H-86.9 ; also sheet 1,2,3,4,5,7,8
ACC0: ADDER-L-283.5 AND-L-08.1 OR-L-32.1 XOR-L-86.1 ; also sheet 5,7
ACC1: ADDER-L-283.3 AND-L-08.4 OR-L-32.4 XOR-L-86.4 ; also sheet 5,7
ACC2: ADDER-L-283.14 AND-L-08.13 OR-L-32.13 XOR-L-86.13 ; also sheet 5,7
ACC3: ADDER-L-283.12 AND-L-08.10 OR-L-32.10 XOR-L-86.10 ; also sheet 5,7
ACC4: ADDER-H-283.5 AND-H-08.1 OR-H-32.1 XOR-H-86.1 ; also sheet 5,7
ACC5: ADDER-H-283.3 AND-H-08.4 OR-H-32.4 XOR-H-86.4 ; also sheet 5,7
ACC6: ADDER-H-283.14 AND-H-08.13 OR-H-32.13 XOR-H-86.13 ; also sheet 5,7
ACC7: ADDER-H-283.12 AND-H-08.10 OR-H-32.10 XOR-H-86.10 ; also sheet 5,7
ADDER0: ADDER0.2 ADDER-B-245.9 ADDER-L-283.4 ; also sheet 7
ADDER1: ADDER1.2 ADDER-B-245.8 ADDER-L-283.1 ; also sheet 7
ADDER2: ADDER2.2 ADDER-B-245.7 ADDER-L-283.13 ; also sheet 7
ADDER3: ADDER3.2 ADDER-B-245.6 ADDER-L-283.10 ; also sheet 7
ADDER4: ADDER4.2 ADDER-B-245.5 ADDER-H-283.4 ; also sheet 7
ADDER5: ADDER5.2 ADDER-B-245.4 ADDER-H-283.1 ; also sheet 7
ADDER6: ADDER6.2 ADDER-B-245.3 ADDER-H-283.13 ; also sheet 7
ADDER7: ADDER7.2 ADDER-B-245.2 ADDER-H-283.10 ; also sheet 7,8
ADDER-B: ADDER-B-245.19 ; also sheet 8
AND0: AND0.2 AND-B-245.9 AND-L-08.3
AND1: AND1.2 AND-B-245.8 AND-L-08.6
AND2: AND2.2 AND-B-245.7 AND-L-08.11
AND3: AND3.2 AND-B-245.6 AND-L-08.8
AND4: AND4.2 AND-B-245.5 AND-H-08.3
AND5: AND5.2 AND-B-245.4 AND-H-08.6
AND6: AND6.2 AND-B-245.3 AND-H-08.11
AND7: AND7.2 AND-B-245.2 AND-H-08.8
AND-B: AND-B-245.19 ; also sheet 8
B0: ADDER-B-245.11 AND-B-245.11 NOT-B-245.11 OR-B-245.11 XOR-B-245.11 ; also sheet 1,2,3,4,5,7,8
B1: ADDER-B-245.12 AND-B-245.12 NOT-B-245.12 OR-B-245.12 XOR-B-245.12 ; also sheet 1,2,3,4,5,7,8
B2: ADDER-B-245.13 AND-B-245.13 NOT-B-245.13 OR-B-245.13 XOR-B-245.13 ; also sheet 1,2,3,4,5,7,8
B3: ADDER-B-245.14 AND-B-245.14 NOT-B-245.14 OR-B-245.14 XOR-B-245.14 ; also sheet 1,2,3,4,5,7,8
B4: ADDER-B-245.15 AND-B-245.15 NOT-B-245.15 OR-B-245.15 XOR-B-245.15 ; also sheet 1,2,3,4,5,7,8
B5: ADDER-B-245.16 AND-B-245.16 NOT-B-245.16 OR-B-245.16 XOR-B-245.16 ; also sheet 1,2,3,4,5,7,8
B6: ADDER-B-245.17 AND-B-245.17 NOT-B-245.17 OR-B-245.17 XOR-B-245.17 ; also sheet 1,2,3,4,5,7,8
B7: ADDER-B-245.18 AND-B-245.18 NOT-B-245.18 OR-B-245.18 XOR-B-245.18 ; also sheet 1,2,3,4,5,7,8
C4: ADDER-C4.2 ADDER-H-283.7 ADDER-L-283.9
GND: ADDER0.1 ADDER1.1 ADDER2.1 ADDER3.1 ADDER4.1 ADDER5.1 ADDER6.1 ADDER7.1 ADDER-B-245.10 ADDER-C4.1 ADDER-H-86.7 ADDER-H-283.8 ADDER-L-86.7 ADDER-L-283.8 AND0.1 AND1.1 AND2.1 AND3.1 AND4.1 AND5.1 AND6.1 AND7.1 AND-B-245.10 AND-H-08.7 AND-L-08.7 NOT0.1 NOT1.1 NOT2.1 NOT3.1 NOT4.1 NOT5.1 NOT6.1 NOT7.1 NOT-B-245.10 NOT-H-04.7 NOT-L-04.7 OR0.1 OR1.1 OR2.1 OR3.1 OR4.1 OR5.1 OR6.1 OR7.1 OR-B-245.10 OR-H-32.7 OR-L-32.7 OVERFLOW.1 T0.1 T1.1 T2.1 T3.1 T4.1 T5.1 T6.1 T7.1 XOR0.1 XOR1.1 XOR2.1 XOR3.1 XOR4.1 XOR5.1 XOR6.1 XOR7.1 XOR-B-245.10 XOR-H-86.7 XOR-L-86.7 ; also sheet 1,2,3,4,5,7,8
NOT0: NOT0.2 NOT-B-245.9 NOT-L-04.8
NOT1: NOT1.2 NOT-B-245.8 NOT-L-04.10
NOT2: NOT2.2 NOT-B-245.7 NOT-L-04.12
NOT3: NOT3.2 NOT-B-245.6 NOT-L-04.2
NOT4: NOT4.2 NOT-B-245.5 NOT-H-04.8
NOT5: NOT5.2 NOT-B-245.4 NOT-H-04.10
NOT6: NOT6.2 NOT-B-245.3 NOT-H-04.12
NOT7: NOT7.2 NOT-B-245.2 NOT-H-04.2
NOT-B: NOT-B-245.19 ; also sheet 8
OR0: OR0.2 OR-B-245.9 OR-L-32.3
OR1: OR1.2 OR-B-245.8 OR-L-32.6
OR2: OR2.2 OR-B-245.7 OR-L-32.11
OR3: OR3.2 OR-B-245.6 OR-L-32.8
OR4: OR4.2 OR-B-245.5 OR-H-32.3
OR5: OR5.2 OR-B-245.4 OR-H-32.6
OR6: OR6.2 OR-B-245.3 OR-H-32.11
OR7: OR7.2 OR-B-245.2 OR-H-32.8
OR-B: OR-B-245.19 ; also sheet 8
OVERFLOW: ADDER-H-283.9 OVERFLOW.2 ; also sheet 7
SUB: ADDER-H-86.1 ADDER-H-86.4 ADDER-H-86.10 ADDER-H-86.13 ADDER-L-86.1 ADDER-L-86.4 ADDER-L-86.10 ADDER-L-86.12 ADDER-L-283.7 ; also sheet 8
T0: ADDER-L-86.3 ADDER-L-283.6 T0.2
T1: ADDER-L-86.6 ADDER-L-283.2 T1.2
T2: ADDER-L-86.11 ADDER-L-283.15 T2.2
T3: ADDER-L-86.8 ADDER-L-283.11 T3.2
T4: ADDER-H-86.3 ADDER-H-283.6 T4.2
T5: ADDER-H-86.6 ADDER-H-283.2 T5.2
T6: ADDER-H-86.11 ADDER-H-283.15 T6.2
T7: ADDER-H-86.8 ADDER-H-283.11 T7.2
VCC: ADDER-B-245.1 ADDER-B-245.20 ADDER-H-86.14 ADDER-H-283.16 ADDER-L-86.14 ADDER-L-283.16 AND-B-245.1 AND-B-245.20 AND-H-08.14 AND-L-08.14 NOT-B-245.1 NOT-B-245.20 NOT-H-04.14 NOT-L-04.14 OR-B-245.1 OR-B-245.20 OR-H-32.14 OR-L-32.14 XOR-B-245.1 XOR-B-245.20 XOR-H-86.14 XOR-L-86.14 ; also sheet 1,2,3,4,5,7,8
XOR0: XOR0.2 XOR-B-245.9 XOR-L-86.3
XOR1: XOR1.2 XOR-B-245.8 XOR-L-86.6
XOR2: XOR2.2 XOR-B-245.7 XOR-L-86.11
XOR3: XOR3.2 XOR-B-245.6 XOR-L-86.8
XOR4: XOR4.2 XOR-B-245.5 XOR-H-86.3
XOR5: XOR5.2 XOR-B-245.4 XOR-H-86.6
XOR6: XOR6.2 XOR-B-245.3 XOR-H-86.11
XOR7: XOR7.2 XOR-B-245.2 XOR-H-86.8
XOR-B: XOR-B-245.19 ; also sheet 8
Unconnected: NOT-H-04.3 NOT-H-04.4 NOT-H-04.5 NOT-H-04.6 NOT-L-04.3 NOT-L-04.4 NOT-L-04.5 NOT-L-04.6

### Notes on the sheet
- Cube
- ALU and Registers
- ALU - Adder, AND, 
  OR, NOT, XOR
- Matej Dinis

## Sheet 7 of 8: ALU SL,SR, CMP
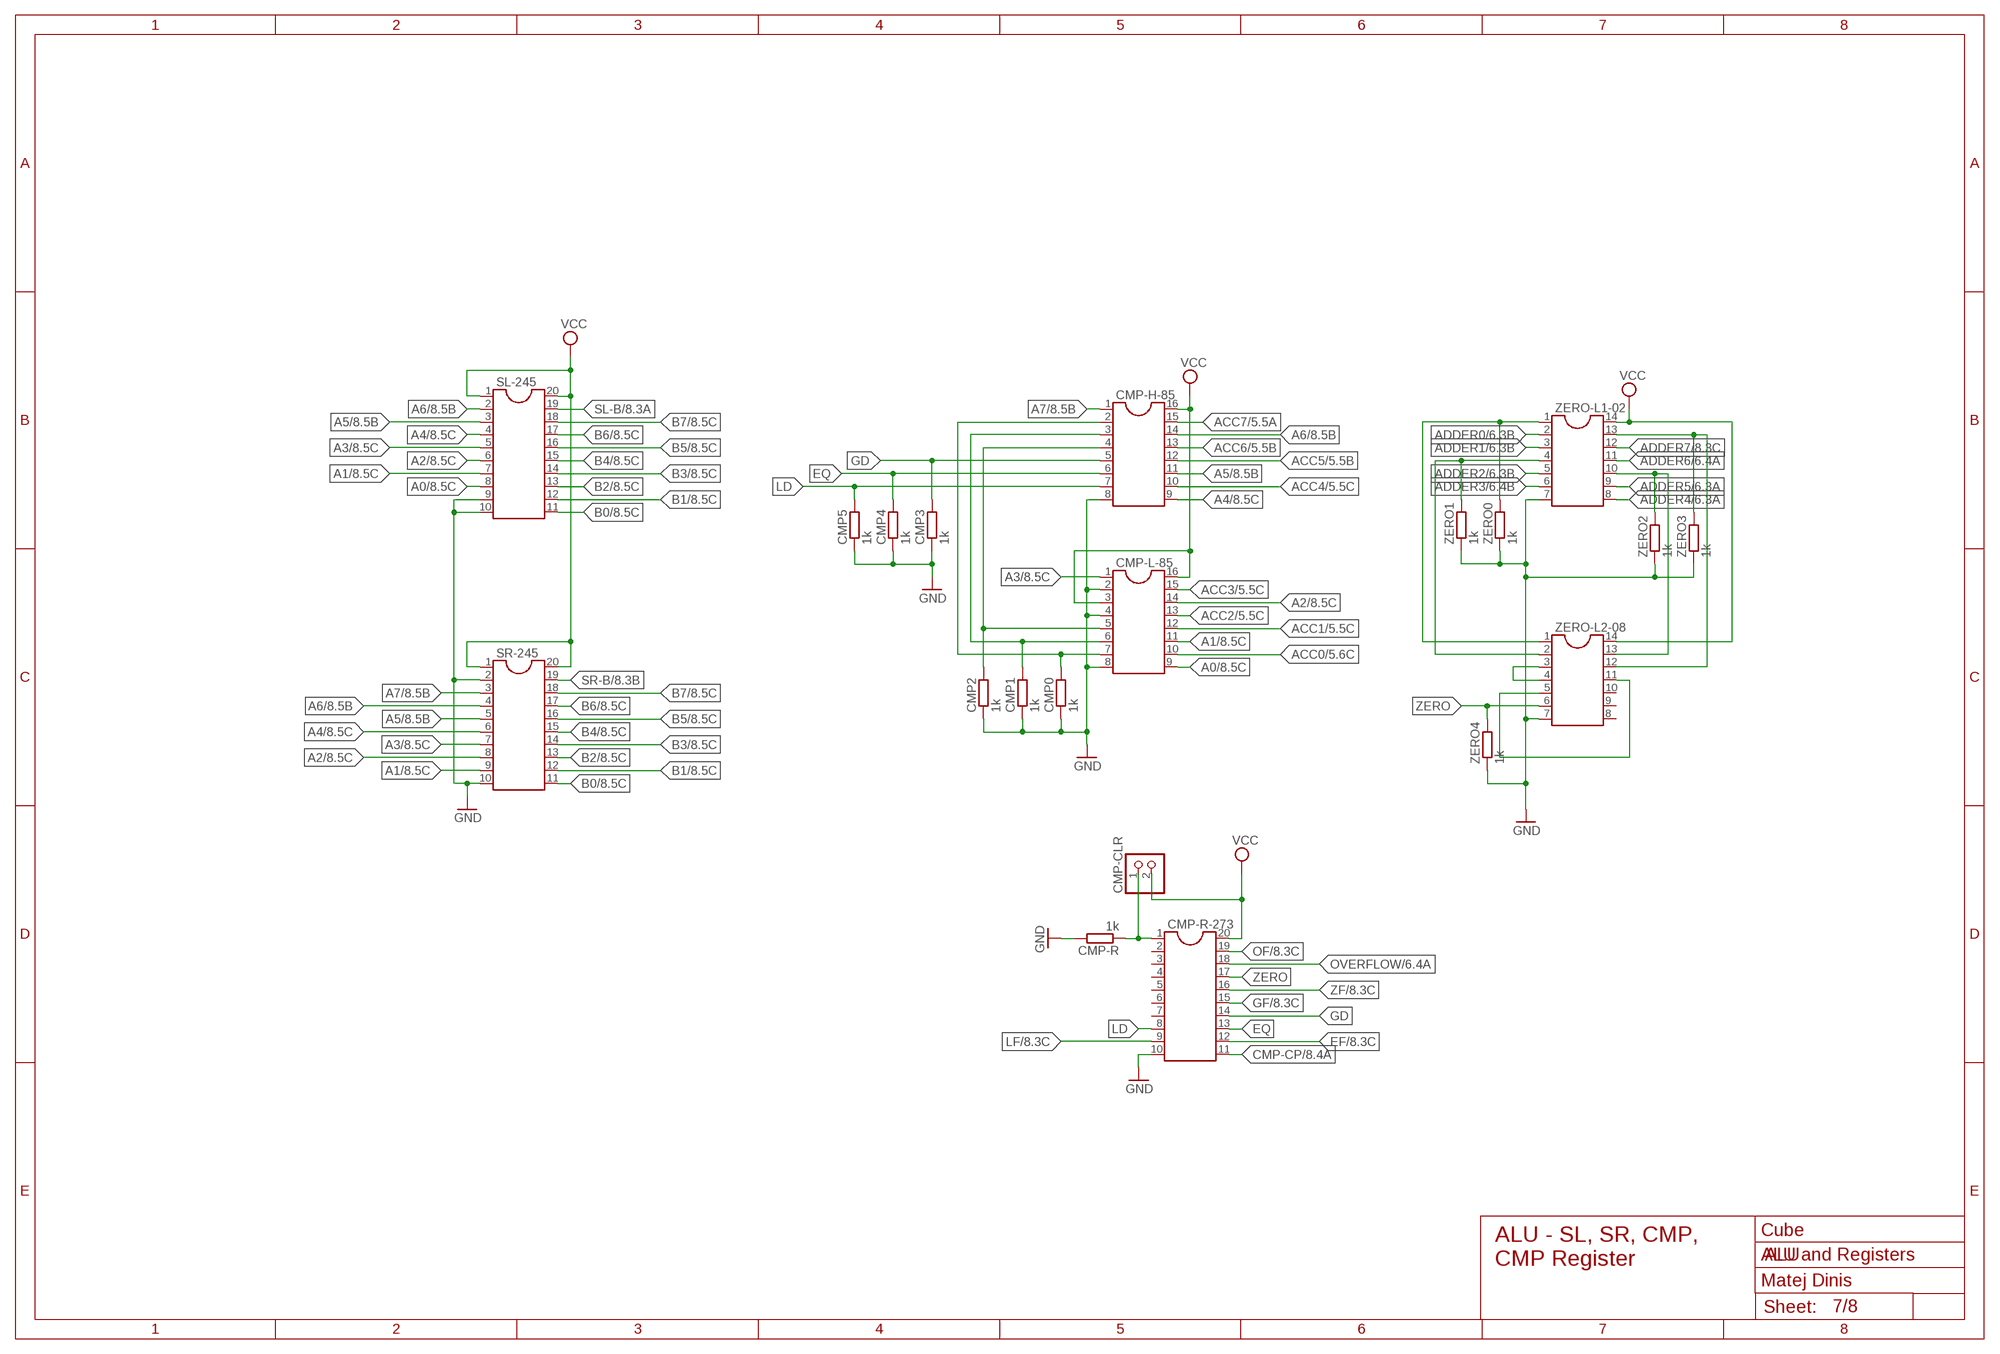
[diagram p6: schematic, sheet 7]

### Parts
CMP0  1k  R-EU_0204/7  [0204/7]
CMP1  1k  R-EU_0204/7  [0204/7]
CMP2  1k  R-EU_0204/7  [0204/7]
CMP3  1k  R-EU_0204/7  [0204/7]
CMP4  1k  R-EU_0204/7  [0204/7]
CMP5  1k  R-EU_0204/7  [0204/7]
CMP-CLR  PINHD-1X2  [1X02]
CMP-H-85  DIL16S  [SOCKET-16]
CMP-L-85  DIL16S  [SOCKET-16]
CMP-R  1k  R-EU_0204/7  [0204/7]
CMP-R-273  DIL20S  [SOCKET-20]
SL-245  DIL20S  [SOCKET-20]
SR-245  DIL20S  [SOCKET-20]
ZERO0  1k  R-EU_0204/7  [0204/7]
ZERO1  1k  R-EU_0204/7  [0204/7]
ZERO2  1k  R-EU_0204/7  [0204/7]
ZERO3  1k  R-EU_0204/7  [0204/7]
ZERO4  1k  R-EU_0204/7  [0204/7]
ZERO-L1-02  DIL14S  [SOCKET-14]
ZERO-L2-08  DIL14S  [SOCKET-14]

### Nets
A0: CMP-L-85.9 SL-245.8 ; also sheet 1,2,3,4,5,6,8
A1: CMP-L-85.11 SL-245.7 SR-245.9 ; also sheet 1,2,3,4,5,6,8
A2: CMP-L-85.14 SL-245.6 SR-245.8 ; also sheet 1,2,3,4,5,6,8
A3: CMP-L-85.1 SL-245.5 SR-245.7 ; also sheet 1,2,3,4,5,6,8
A4: CMP-H-85.9 SL-245.4 SR-245.6 ; also sheet 1,2,3,4,5,6,8
A5: CMP-H-85.11 SL-245.3 SR-245.5 ; also sheet 1,2,3,4,5,6,8
A6: CMP-H-85.14 SL-245.2 SR-245.4 ; also sheet 1,2,3,4,5,6,8
A7: CMP-H-85.1 SR-245.3 ; also sheet 1,2,3,4,5,6,8
A<B: CMP0.2 CMP-H-85.2 CMP-L-85.7
A=B: CMP1.2 CMP-H-85.3 CMP-L-85.6
A>B: CMP2.2 CMP-H-85.4 CMP-L-85.5
ACC0: CMP-L-85.10 ; also sheet 5,6
ACC1: CMP-L-85.12 ; also sheet 5,6
ACC2: CMP-L-85.13 ; also sheet 5,6
ACC3: CMP-L-85.15 ; also sheet 5,6
ACC4: CMP-H-85.10 ; also sheet 5,6
ACC5: CMP-H-85.12 ; also sheet 5,6
ACC6: CMP-H-85.13 ; also sheet 5,6
ACC7: CMP-H-85.15 ; also sheet 5,6
ADDER0: ZERO-L1-02.2 ; also sheet 6
ADDER1: ZERO-L1-02.3 ; also sheet 6
ADDER2: ZERO-L1-02.5 ; also sheet 6
ADDER3: ZERO-L1-02.6 ; also sheet 6
ADDER4: ZERO-L1-02.8 ; also sheet 6
ADDER5: ZERO-L1-02.9 ; also sheet 6
ADDER6: ZERO-L1-02.11 ; also sheet 6
ADDER7: ZERO-L1-02.12 ; also sheet 6,8
B0: SL-245.11 SR-245.11 ; also sheet 1,2,3,4,5,6,8
B1: SL-245.12 SR-245.12 ; also sheet 1,2,3,4,5,6,8
B2: SL-245.13 SR-245.13 ; also sheet 1,2,3,4,5,6,8
B3: SL-245.14 SR-245.14 ; also sheet 1,2,3,4,5,6,8
B4: SL-245.15 SR-245.15 ; also sheet 1,2,3,4,5,6,8
B5: SL-245.16 SR-245.16 ; also sheet 1,2,3,4,5,6,8
B6: SL-245.17 SR-245.17 ; also sheet 1,2,3,4,5,6,8
B7: SL-245.18 SR-245.18 ; also sheet 1,2,3,4,5,6,8
CMP-CLR: CMP-CLR.1 CMP-R-273.1 CMP-R.1
CMP-CP: CMP-R-273.11 ; also sheet 8
EF: CMP-R-273.12 ; also sheet 8
EQ: CMP4.2 CMP-H-85.6 CMP-R-273.13
GD: CMP3.2 CMP-H-85.5 CMP-R-273.14
GF: CMP-R-273.15 ; also sheet 8
GND: CMP0.1 CMP1.1 CMP2.1 CMP3.1 CMP4.1 CMP5.1 CMP-H-85.8 CMP-L-85.2 CMP-L-85.4 CMP-L-85.8 CMP-R-273.10 CMP-R.2 SL-245.9 SL-245.10 SR-245.2 SR-245.10 ZERO0.1 ZERO1.1 ZERO2.1 ZERO3.1 ZERO4.1 ZERO-L1-02.7 ZERO-L2-08.7 ; also sheet 1,2,3,4,5,6,8
LD: CMP5.2 CMP-H-85.7 CMP-R-273.8
LF: CMP-R-273.9 ; also sheet 8
OF: CMP-R-273.19 ; also sheet 8
OVERFLOW: CMP-R-273.18 ; also sheet 6
SL-B: SL-245.19 ; also sheet 8
SR-B: SR-245.19 ; also sheet 8
VCC: CMP-CLR.2 CMP-H-85.16 CMP-L-85.3 CMP-L-85.16 CMP-R-273.20 SL-245.1 SL-245.20 SR-245.1 SR-245.20 ZERO-L1-02.14 ZERO-L2-08.14 ; also sheet 1,2,3,4,5,6,8
ZERO: CMP-R-273.17 ZERO4.2 ZERO-L2-08.6
ZERO0: ZERO0.2 ZERO-L1-02.1 ZERO-L2-08.1
ZERO1: ZERO1.2 ZERO-L1-02.4 ZERO-L2-08.2
ZERO2: ZERO2.2 ZERO-L1-02.10 ZERO-L2-08.13
ZERO3: ZERO3.2 ZERO-L1-02.13 ZERO-L2-08.12
ZERO4: ZERO-L2-08.3 ZERO-L2-08.4
ZERO5: ZERO-L2-08.5 ZERO-L2-08.11
ZF: CMP-R-273.16 ; also sheet 8
Unconnected: CMP-R-273.2 CMP-R-273.3 CMP-R-273.4 CMP-R-273.5 CMP-R-273.6 CMP-R-273.7 ZERO-L2-08.8 ZERO-L2-08.9 ZERO-L2-08.10

### Notes on the sheet
- Cube
- ALU and Registers
- ALU - SL, SR, CMP, 
  CMP Register
- Matej Dinis

## Sheet 8 of 8: IO pins
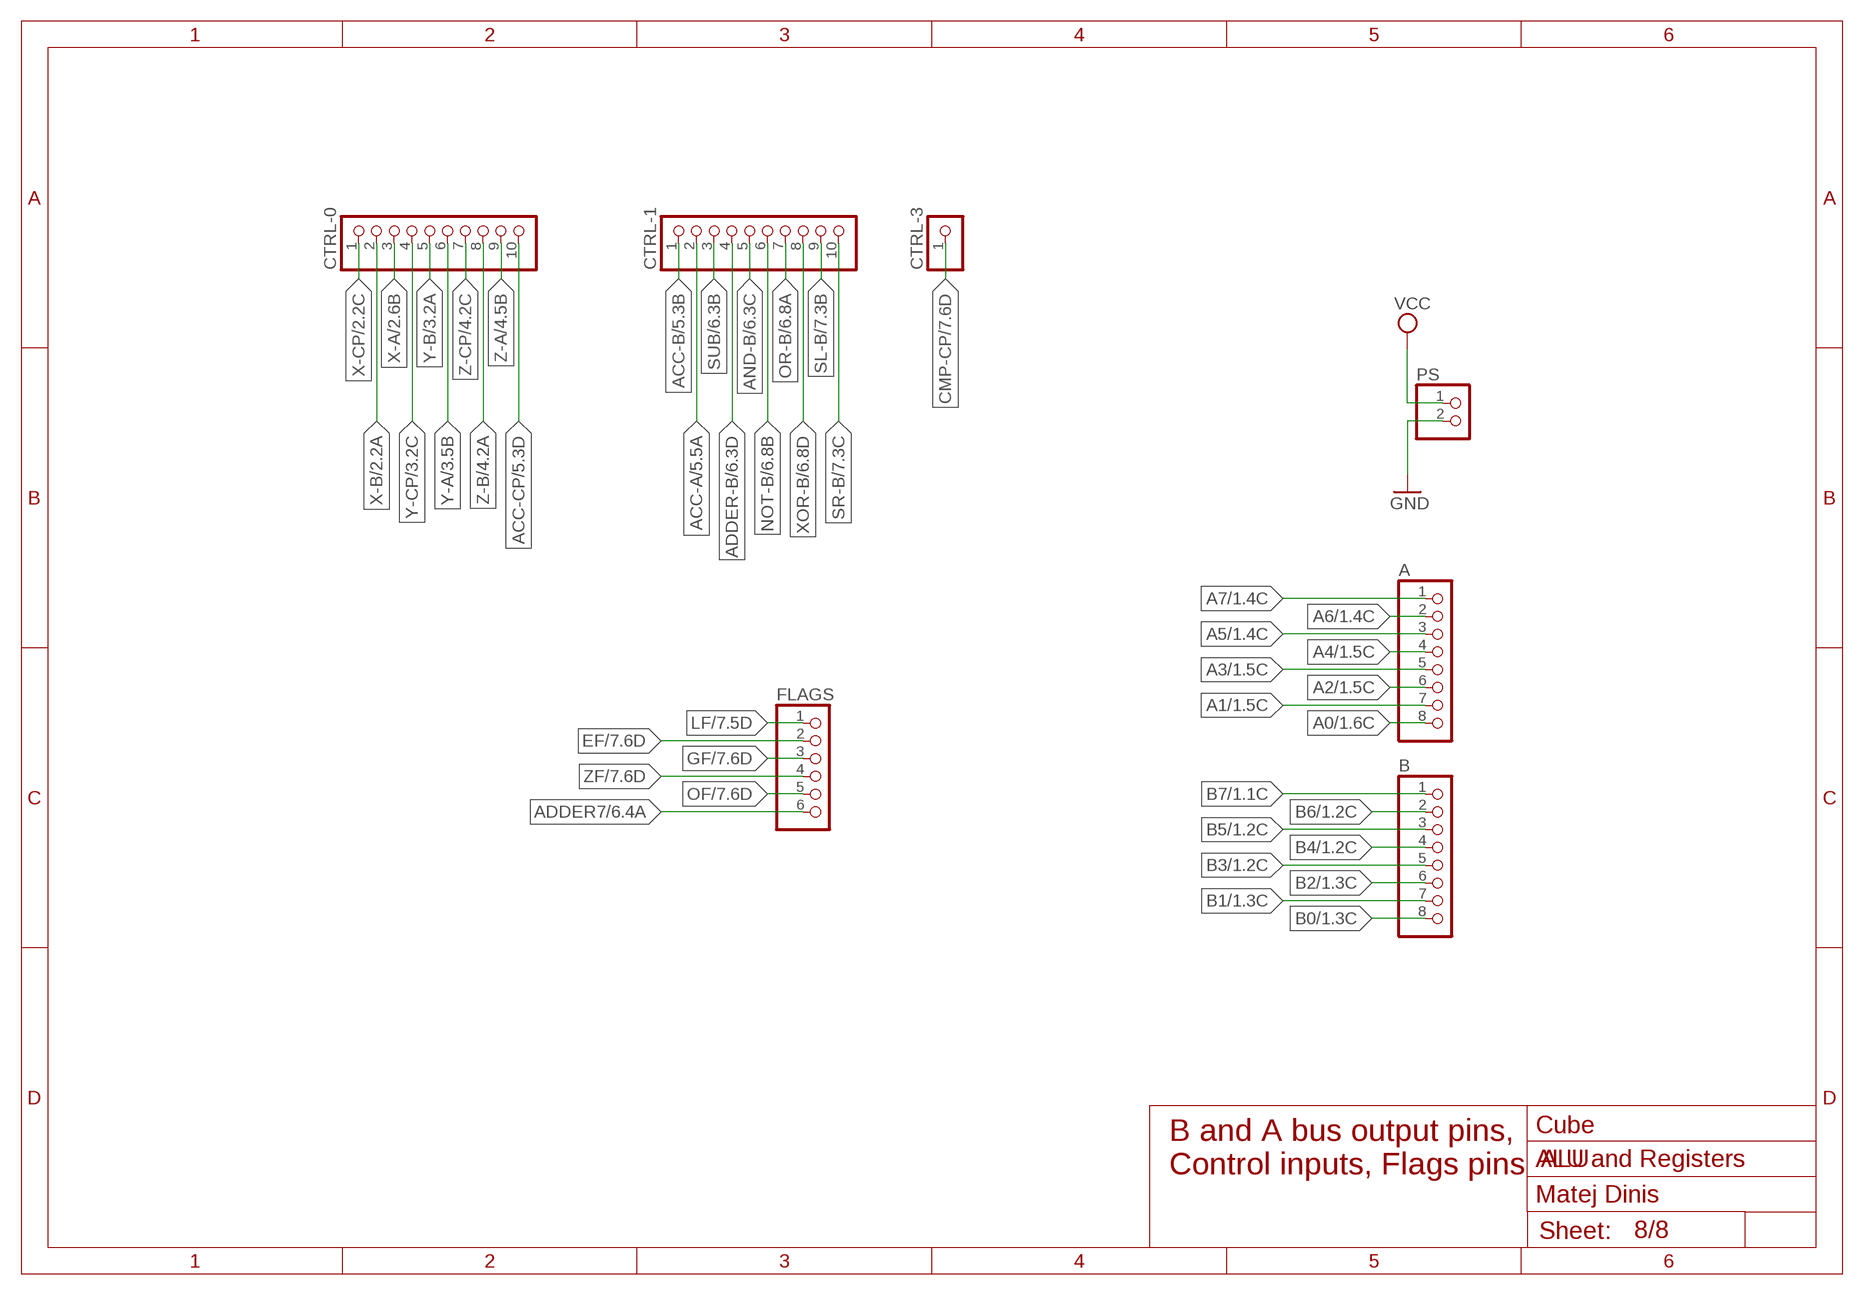
[diagram p7: schematic, sheet 8]

### Parts
A  PINHD-1X8  [1X08]
B  PINHD-1X8  [1X08]
CTRL-0  PINHD-1X10  [1X10]
CTRL-1  PINHD-1X10  [1X10]
CTRL-3  PINHD-1X1  [1X01]
FLAGS  PINHD-1X6  [1X06]
PS  PINHD-1X2  [1X02]

### Nets
A0: A.8 ; also sheet 1,2,3,4,5,6,7
A1: A.7 ; also sheet 1,2,3,4,5,6,7
A2: A.6 ; also sheet 1,2,3,4,5,6,7
A3: A.5 ; also sheet 1,2,3,4,5,6,7
A4: A.4 ; also sheet 1,2,3,4,5,6,7
A5: A.3 ; also sheet 1,2,3,4,5,6,7
A6: A.2 ; also sheet 1,2,3,4,5,6,7
A7: A.1 ; also sheet 1,2,3,4,5,6,7
ACC-A: CTRL-1.2 ; also sheet 5
ACC-B: CTRL-1.1 ; also sheet 5
ACC-CP: CTRL-0.10 ; also sheet 5
ADDER7: FLAGS.6 ; also sheet 6,7
ADDER-B: CTRL-1.4 ; also sheet 6
AND-B: CTRL-1.5 ; also sheet 6
B0: B.8 ; also sheet 1,2,3,4,5,6,7
B1: B.7 ; also sheet 1,2,3,4,5,6,7
B2: B.6 ; also sheet 1,2,3,4,5,6,7
B3: B.5 ; also sheet 1,2,3,4,5,6,7
B4: B.4 ; also sheet 1,2,3,4,5,6,7
B5: B.3 ; also sheet 1,2,3,4,5,6,7
B6: B.2 ; also sheet 1,2,3,4,5,6,7
B7: B.1 ; also sheet 1,2,3,4,5,6,7
CMP-CP: CTRL-3.1 ; also sheet 7
EF: FLAGS.2 ; also sheet 7
GF: FLAGS.3 ; also sheet 7
GND: PS.2 ; also sheet 1,2,3,4,5,6,7
LF: FLAGS.1 ; also sheet 7
NOT-B: CTRL-1.6 ; also sheet 6
OF: FLAGS.5 ; also sheet 7
OR-B: CTRL-1.7 ; also sheet 6
SL-B: CTRL-1.9 ; also sheet 7
SR-B: CTRL-1.10 ; also sheet 7
SUB: CTRL-1.3 ; also sheet 6
VCC: PS.1 ; also sheet 1,2,3,4,5,6,7
X-A: CTRL-0.3 ; also sheet 2
X-B: CTRL-0.2 ; also sheet 2
X-CP: CTRL-0.1 ; also sheet 2
XOR-B: CTRL-1.8 ; also sheet 6
Y-A: CTRL-0.6 ; also sheet 3
Y-B: CTRL-0.5 ; also sheet 3
Y-CP: CTRL-0.4 ; also sheet 3
Z-A: CTRL-0.9 ; also sheet 4
Z-B: CTRL-0.8 ; also sheet 4
Z-CP: CTRL-0.7 ; also sheet 4
ZF: FLAGS.4 ; also sheet 7

### Notes on the sheet
- Cube
- ALU and Registers
- B and A bus output pins,
  Control inputs, Flags pins
- Matej Dinis

## Library data of the parts
A B = pinhead:PINHD-1X8: PIN HEADER
A0 A1-A7 ACC0 ACC1-ACC7 ACC-C ADDER0 ADDER1-ADDER7 ADDER-C4 AND0 AND1-AND7 B0 B1-B7 CMP0 CMP1-CMP5 CMP-R NOT0 NOT1-NOT7 OR0 OR1-OR7 OVERFLOW T0 T1-T7 X0 X1-X7 X-C XOR0 XOR1-XOR7 Y0 Y1-Y7 Y-C Z0 Z1-Z7 Z-C ZERO0 ZERO1-ZERO4 = rcl:R-EU_: RESISTOR, European symbol; SPICEPREFIX: R
ACC-273 ACC-A-245 ACC-B-245 ADDER-B-245 AND-B-245 CMP-R-273 NOT-B-245 OR-B-245 SL-245 SR-245 X-273 X-A-245 X-B-245 XOR-B-245 Y-273 Y-A-245 Y-B-245 Z-273 Z-A-245 Z-B-245 = ic-package:DIL20: Dual In Line / Socket
ACC-CLR CMP-CLR PS X-CLR Y-CLR Z-CLR = pinhead:PINHD-1X2: PIN HEADER
ACCL0 ACCL1-ACCL7 AL0 AL1-AL7 BL0 BL1-BL7 XL0 XL1-XL7 YL0 YL1-YL7 ZL0 ZL1-ZL7 = led:LED: LED OSRAM: - CHIPLED LG R971, LG N971, LY N971, LG Q971, LY Q971, LO R971, LY R971 LH N974, LH R974 LS Q976, LO Q976, LY Q976 LO Q996 - Hyper CHIPLED LW Q18S LB Q993, LB Q99A, LB R99A - SideLED LS A670, LO A670, LY A670, LG A670, LP A670 LB A673, LV A673, LT A673, LW A673 LH A674 LY A675 LS A676, LA A676, LO A676, LY A676, LW A676 LS A679, LY A679, LG A679 - Hyper Micro SIDELED® LS Y876, LA Y876, LO Y876, LY Y876 LT Y87S - SmartLED LW L88C, LW L88S LB L89C, LB L89S, LG L890 LS L89K, LO L89K, LY L89K LS L896, LA L896, LO L896, LY L896 - TOPLED LS T670, LO T670, LY T670, LG T670, LP T670 LSG T670, LSP T670, LSY T670, LOP T670, LYG T670 LG T671, LOG T671, LSG T671 LB T673, LV T673, LT T673, LW T673 LH T674 LS T676, LA T676, LO T676, LY T676, LB T676, LH T676, LSB T676, LW T676 LB T67C, LV T67C, LT T67C, LS T67K, LO T67K, LY T67K, LW E67C LS E67B, LA E67B, LO E67B, LY E67B, LB E67C, LV E67C, LT E67C LW T67C LS T679, LY T679, LG T679 LS T770, LO T770, LY T770, LG T770, LP T770 LB T773, LV T773, LT T773, LW T773 LH T774 LS E675, LA E675, LY E675, LS T675 LS T776, LA T776, LO T776, LY T776, LB T776 LHGB T686 LT T68C, LB T68C - Hyper Mini TOPLED® LB M676 - Mini TOPLED Santana® LG M470 LS M47K, LO M47K, LY M47K Source: http://www.osram.convergy.de LUXEON: - LUMILED® LXK2-PW12-R00, LXK2-PW12-S00, LXK2-PW14-U00, LXK2-PW14-V00 LXK2-PM12-R00, LXK2-PM12-S00, LXK2-PM14-U00 LXK2-PE12-Q00, LXK2-PE12-R00, LXK2-PE12-S00, LXK2-PE14-T00, LXK2-PE14-U00 LXK2-PB12-K00, LXK2-PB12-L00, LXK2-PB12-M00, LXK2-PB14-N00, LXK2-PB14-P00, LXK2-PB14-Q00 LXK2-PR12-L00, LXK2-PR12-M00, LXK2-PR14-Q00, LXK2-PR14-R00 LXK2-PD12-Q00, LXK2-PD12-R00, LXK2-PD12-S00 LXK2-PH12-R00, LXK2-PH12-S00 LXK2-PL12-P00, LXK2-PL12-Q00, LXK2-PL12-R00 Source: www.luxeon.com KINGBRIGHT: KA-3528ASYC Source: www.kingbright.com
ADDER-H-86 ADDER-L-86 AND-H-08 AND-L-08 NOT-H-04 NOT-L-04 OR-H-32 OR-L-32 XOR-H-86 XOR-L-86 ZERO-L1-02 ZERO-L2-08 = ic-package:DIL14: Dual In Line / Socket
ADDER-H-283 ADDER-L-283 CMP-H-85 CMP-L-85 = ic-package:DIL16: Dual In Line / Socket
C1-C8 = rcl:CPOL-EU: POLARIZED CAPACITOR, European symbol; SPICEPREFIX: C
CTRL-0 CTRL-1 = pinhead:PINHD-1X10: PIN HEADER
CTRL-3 = pinhead:PINHD-1X1: PIN HEADER
FLAGS = pinhead:PINHD-1X6: PIN HEADER